# Altium project Shuttler_AMC.PrjPcb (part 17 of 20)

## Sheet FPGA_Banks_67_68.SchDoc: =ProjectName
size 420 x 297 mm; Author: T.P.; CompanyName: WUT; DrawnBy: T.P.; Organization: WUT ISE; Address1: Warsaw Univeristy of Technology; Address2: Nowowiejska 15/19; DocumentNumber: 9; Revision: 0.9; SheetNumber: 9; SheetTotal: 36; EDA_Number: ARTIQ; Projet: ARTIQ/SINARA; ModifiedBy: -; CreateDate: XX/XX/XXXX; CheckedDate: -; Title2: FPGA_Banks_67_68.SchDoc; DivGrp: ISE; Designer: G.K. and T.P.; ModifiedDate: -; ProjectName: ADC/DAC MEZZANINE
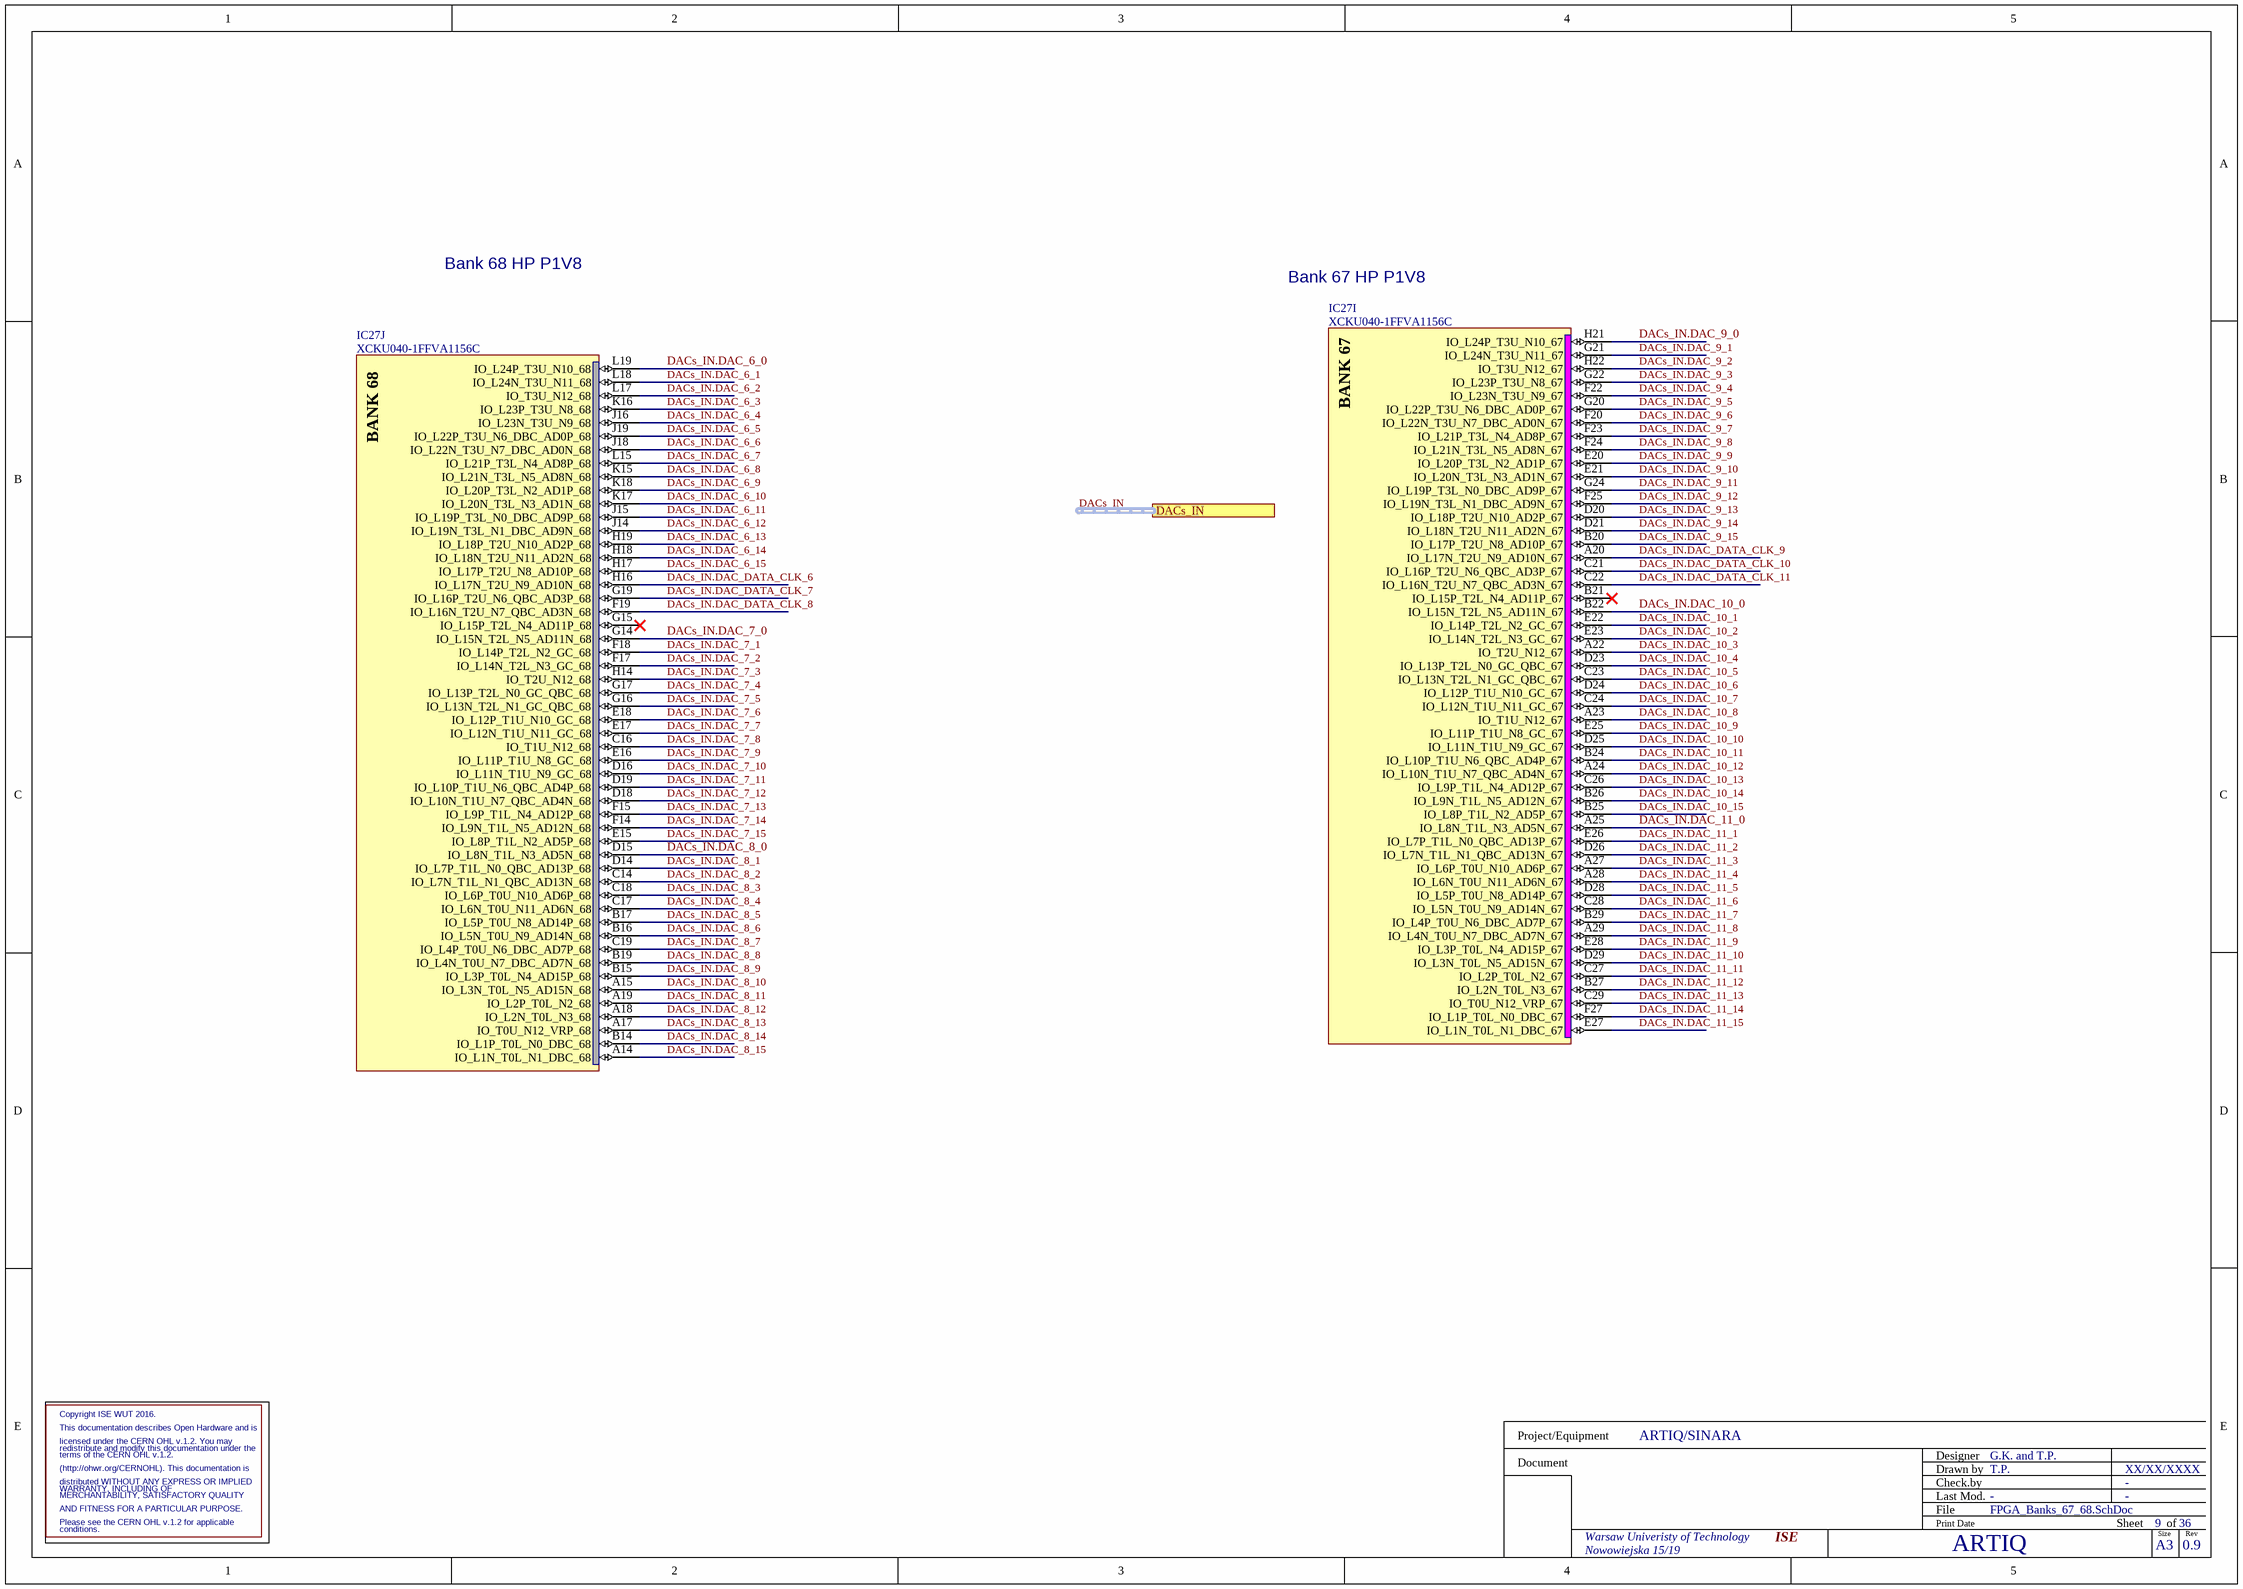
[diagram p31: FPGA_Banks_67_68.SchDoc]

### Parts
IC27  XCKU040-1FFVA1156C  [BGA1156C100P34X34_3500X3500X350]  (parts I,J of 22)

### Ports
DACs_IN (harness DAC_IN)

### Nets
DACs_IN.DAC_6_0: IC27.L19(IO_L24P_T3U_N10_68)
DACs_IN.DAC_6_1: IC27.L18(IO_L24N_T3U_N11_68)
DACs_IN.DAC_6_2: IC27.L17(IO_T3U_N12_68)
DACs_IN.DAC_6_3: IC27.K16(IO_L23P_T3U_N8_68)
DACs_IN.DAC_6_4: IC27.J16(IO_L23N_T3U_N9_68)
DACs_IN.DAC_6_5: IC27.J19(IO_L22P_T3U_N6_DBC_AD0P_68)
DACs_IN.DAC_6_6: IC27.J18(IO_L22N_T3U_N7_DBC_AD0N_68)
DACs_IN.DAC_6_7: IC27.L15(IO_L21P_T3L_N4_AD8P_68)
DACs_IN.DAC_6_8: IC27.K15(IO_L21N_T3L_N5_AD8N_68)
DACs_IN.DAC_6_9: IC27.K18(IO_L20P_T3L_N2_AD1P_68)
DACs_IN.DAC_6_10: IC27.K17(IO_L20N_T3L_N3_AD1N_68)
DACs_IN.DAC_6_11: IC27.J15(IO_L19P_T3L_N0_DBC_AD9P_68)
DACs_IN.DAC_6_12: IC27.J14(IO_L19N_T3L_N1_DBC_AD9N_68)
DACs_IN.DAC_6_13: IC27.H19(IO_L18P_T2U_N10_AD2P_68)
DACs_IN.DAC_6_14: IC27.H18(IO_L18N_T2U_N11_AD2N_68)
DACs_IN.DAC_6_15: IC27.H17(IO_L17P_T2U_N8_AD10P_68)
DACs_IN.DAC_7_0: IC27.G14(IO_L15N_T2L_N5_AD11N_68)
DACs_IN.DAC_7_1: IC27.F18(IO_L14P_T2L_N2_GC_68)
DACs_IN.DAC_7_2: IC27.F17(IO_L14N_T2L_N3_GC_68)
DACs_IN.DAC_7_3: IC27.H14(IO_T2U_N12_68)
DACs_IN.DAC_7_4: IC27.G17(IO_L13P_T2L_N0_GC_QBC_68)
DACs_IN.DAC_7_5: IC27.G16(IO_L13N_T2L_N1_GC_QBC_68)
DACs_IN.DAC_7_6: IC27.E18(IO_L12P_T1U_N10_GC_68)
DACs_IN.DAC_7_7: IC27.E17(IO_L12N_T1U_N11_GC_68)
DACs_IN.DAC_7_8: IC27.C16(IO_T1U_N12_68)
DACs_IN.DAC_7_9: IC27.E16(IO_L11P_T1U_N8_GC_68)
DACs_IN.DAC_7_10: IC27.D16(IO_L11N_T1U_N9_GC_68)
DACs_IN.DAC_7_11: IC27.D19(IO_L10P_T1U_N6_QBC_AD4P_68)
DACs_IN.DAC_7_12: IC27.D18(IO_L10N_T1U_N7_QBC_AD4N_68)
DACs_IN.DAC_7_13: IC27.F15(IO_L9P_T1L_N4_AD12P_68)
DACs_IN.DAC_7_14: IC27.F14(IO_L9N_T1L_N5_AD12N_68)
DACs_IN.DAC_7_15: IC27.E15(IO_L8P_T1L_N2_AD5P_68)
DACs_IN.DAC_8_0: IC27.D15(IO_L8N_T1L_N3_AD5N_68)
DACs_IN.DAC_8_1: IC27.D14(IO_L7P_T1L_N0_QBC_AD13P_68)
DACs_IN.DAC_8_2: IC27.C14(IO_L7N_T1L_N1_QBC_AD13N_68)
DACs_IN.DAC_8_3: IC27.C18(IO_L6P_T0U_N10_AD6P_68)
DACs_IN.DAC_8_4: IC27.C17(IO_L6N_T0U_N11_AD6N_68)
DACs_IN.DAC_8_5: IC27.B17(IO_L5P_T0U_N8_AD14P_68)
DACs_IN.DAC_8_6: IC27.B16(IO_L5N_T0U_N9_AD14N_68)
DACs_IN.DAC_8_7: IC27.C19(IO_L4P_T0U_N6_DBC_AD7P_68)
DACs_IN.DAC_8_8: IC27.B19(IO_L4N_T0U_N7_DBC_AD7N_68)
DACs_IN.DAC_8_9: IC27.B15(IO_L3P_T0L_N4_AD15P_68)
DACs_IN.DAC_8_10: IC27.A15(IO_L3N_T0L_N5_AD15N_68)
DACs_IN.DAC_8_11: IC27.A19(IO_L2P_T0L_N2_68)
DACs_IN.DAC_8_12: IC27.A18(IO_L2N_T0L_N3_68)
DACs_IN.DAC_8_13: IC27.A17(IO_T0U_N12_VRP_68)
DACs_IN.DAC_8_14: IC27.B14(IO_L1P_T0L_N0_DBC_68)
DACs_IN.DAC_8_15: IC27.A14(IO_L1N_T0L_N1_DBC_68)
DACs_IN.DAC_9_0: IC27.H21(IO_L24P_T3U_N10_67)
DACs_IN.DAC_9_1: IC27.G21(IO_L24N_T3U_N11_67)
DACs_IN.DAC_9_2: IC27.H22(IO_T3U_N12_67)
DACs_IN.DAC_9_3: IC27.G22(IO_L23P_T3U_N8_67)
DACs_IN.DAC_9_4: IC27.F22(IO_L23N_T3U_N9_67)
DACs_IN.DAC_9_5: IC27.G20(IO_L22P_T3U_N6_DBC_AD0P_67)
DACs_IN.DAC_9_6: IC27.F20(IO_L22N_T3U_N7_DBC_AD0N_67)
DACs_IN.DAC_9_7: IC27.F23(IO_L21P_T3L_N4_AD8P_67)
DACs_IN.DAC_9_8: IC27.F24(IO_L21N_T3L_N5_AD8N_67)
DACs_IN.DAC_9_9: IC27.E20(IO_L20P_T3L_N2_AD1P_67)
DACs_IN.DAC_9_10: IC27.E21(IO_L20N_T3L_N3_AD1N_67)
DACs_IN.DAC_9_11: IC27.G24(IO_L19P_T3L_N0_DBC_AD9P_67)
DACs_IN.DAC_9_12: IC27.F25(IO_L19N_T3L_N1_DBC_AD9N_67)
DACs_IN.DAC_9_13: IC27.D20(IO_L18P_T2U_N10_AD2P_67)
DACs_IN.DAC_9_14: IC27.D21(IO_L18N_T2U_N11_AD2N_67)
DACs_IN.DAC_9_15: IC27.B20(IO_L17P_T2U_N8_AD10P_67)
DACs_IN.DAC_10_0: IC27.B22(IO_L15N_T2L_N5_AD11N_67)
DACs_IN.DAC_10_1: IC27.E22(IO_L14P_T2L_N2_GC_67)
DACs_IN.DAC_10_2: IC27.E23(IO_L14N_T2L_N3_GC_67)
DACs_IN.DAC_10_3: IC27.A22(IO_T2U_N12_67)
DACs_IN.DAC_10_4: IC27.D23(IO_L13P_T2L_N0_GC_QBC_67)
DACs_IN.DAC_10_5: IC27.C23(IO_L13N_T2L_N1_GC_QBC_67)
DACs_IN.DAC_10_6: IC27.D24(IO_L12P_T1U_N10_GC_67)
DACs_IN.DAC_10_7: IC27.C24(IO_L12N_T1U_N11_GC_67)
DACs_IN.DAC_10_8: IC27.A23(IO_T1U_N12_67)
DACs_IN.DAC_10_9: IC27.E25(IO_L11P_T1U_N8_GC_67)
DACs_IN.DAC_10_10: IC27.D25(IO_L11N_T1U_N9_GC_67)
DACs_IN.DAC_10_11: IC27.B24(IO_L10P_T1U_N6_QBC_AD4P_67)
DACs_IN.DAC_10_12: IC27.A24(IO_L10N_T1U_N7_QBC_AD4N_67)
DACs_IN.DAC_10_13: IC27.C26(IO_L9P_T1L_N4_AD12P_67)
DACs_IN.DAC_10_14: IC27.B26(IO_L9N_T1L_N5_AD12N_67)
DACs_IN.DAC_10_15: IC27.B25(IO_L8P_T1L_N2_AD5P_67)
DACs_IN.DAC_11_0: IC27.A25(IO_L8N_T1L_N3_AD5N_67)
DACs_IN.DAC_11_1: IC27.E26(IO_L7P_T1L_N0_QBC_AD13P_67)
DACs_IN.DAC_11_2: IC27.D26(IO_L7N_T1L_N1_QBC_AD13N_67)
DACs_IN.DAC_11_3: IC27.A27(IO_L6P_T0U_N10_AD6P_67)
DACs_IN.DAC_11_4: IC27.A28(IO_L6N_T0U_N11_AD6N_67)
DACs_IN.DAC_11_5: IC27.D28(IO_L5P_T0U_N8_AD14P_67)
DACs_IN.DAC_11_6: IC27.C28(IO_L5N_T0U_N9_AD14N_67)
DACs_IN.DAC_11_7: IC27.B29(IO_L4P_T0U_N6_DBC_AD7P_67)
DACs_IN.DAC_11_8: IC27.A29(IO_L4N_T0U_N7_DBC_AD7N_67)
DACs_IN.DAC_11_9: IC27.E28(IO_L3P_T0L_N4_AD15P_67)
DACs_IN.DAC_11_10: IC27.D29(IO_L3N_T0L_N5_AD15N_67)
DACs_IN.DAC_11_11: IC27.C27(IO_L2P_T0L_N2_67)
DACs_IN.DAC_11_12: IC27.B27(IO_L2N_T0L_N3_67)
DACs_IN.DAC_11_13: IC27.C29(IO_T0U_N12_VRP_67)
DACs_IN.DAC_11_14: IC27.F27(IO_L1P_T0L_N0_DBC_67)
DACs_IN.DAC_11_15: IC27.E27(IO_L1N_T0L_N1_DBC_67)
DACs_IN.DAC_DATA_CLK_6: IC27.H16(IO_L17N_T2U_N9_AD10N_68)
DACs_IN.DAC_DATA_CLK_7: IC27.G19(IO_L16P_T2U_N6_QBC_AD3P_68)
DACs_IN.DAC_DATA_CLK_8: IC27.F19(IO_L16N_T2U_N7_QBC_AD3N_68)
DACs_IN.DAC_DATA_CLK_9: IC27.A20(IO_L17N_T2U_N9_AD10N_67)
DACs_IN.DAC_DATA_CLK_10: IC27.C21(IO_L16P_T2U_N6_QBC_AD3P_67)
DACs_IN.DAC_DATA_CLK_11: IC27.C22(IO_L16N_T2U_N7_QBC_AD3N_67)

Not connected (* = marked no-connect by the designer): IC27 B21(IO_L15P_T2L_N4_AD11P_67)* G15(IO_L15P_T2L_N4_AD11P_68)*

### Buses and harness runs
harness DACs_IN = port DACs_IN

### Notes on the sheet
- Bank 68 HP P1V8
- Bank 67 HP P1V8
- Copyright ISE WUT 2016.
- This documentation describes Open Hardware and is
- licensed under the CERN OHL v.1.2. You may
- (http://ohwr.org/CERNOHL). This documentation is
- WARRANTY, INCLUDING OF
- terms of the CERN OHL v.1.2.
- distributed WITHOUT ANY EXPRESS OR IMPLIED
- redistribute and modify this documentation under the
- conditions.
- AND FITNESS FOR A PARTICULAR PURPOSE.
- Please see the CERN OHL v.1.2 for applicable
- MERCHANTABILITY, SATISFACTORY QUALITY
- Project/Equipment
- Document
- Designer
- Drawn by
- Check.by
- File
- Last Mod.
- Print Date
- Sheet
- Size
- A3
- of
- Rev
- (in symbol XCKU040-1FFVA1156C, part I) BANK 67
- (in symbol XCKU040-1FFVA1156C, part J) BANK 68

### Library data of the parts
IC27 = XCKU040-1FFVA1156C: Kintex UltraScale FPGA, 520 I/O, 530K Cells, 1156-Ball BGA, Speed Grade 1, Commercial Grade; Manufacturer: XILINX; Part Description: Kintex UltraScale, 40 DLL I/O, 416 HP I/O, 104 HR I/O, 1156-Pin BGA, Speed Grade 1, Commercial Grade; PressFit: No; Bonding: No; Manufacturer Part Number: XCKU040-1FFVA1156C; PackageDescription: BGA, 1.00mm Pitch, Square; 1156 Pin, 34 Columns X 34 Rows, Body 35.00mm X 35.00mm X 3.50mm H, IPC Medium Density; Part Number: XCKU040-1FFVA1156C; Component Kind: Standard; Component Type: Standard; Device: XCKU040-1FFVA1156C; Pin Count: 1156; Case: BGA1156; Mounted: Yes; Socket: No; SMD: Yes; Sense: No; ComponentHeight: 3.5mm; HelpURL: \\cern.ch\dfs\Applications\Altium\Datasheets\XCKU040-1FFVA1156C.pdf; ComponentLink1URL: \\cern.ch\dfs\Applications\Altium\Datasheets\XCKU040-1FFVA1156C_Package-Pinout.pdf; ComponentLink1Description: Package/Pinout; Author: CERN DEM CA; CreateDate: 16.08.2016; LatestRevisionDate: 16.08.2016

## Sheet FPGA_Bank_66_HP.SchDoc: =ProjectName
size 420 x 297 mm; Author: T.P.; CompanyName: WUT; DrawnBy: T.P.; Organization: WUT ISE; Address1: Warsaw Univeristy of Technology; Address2: Nowowiejska 15/19; DocumentNumber: 8; Revision: 0.9; SheetNumber: 8; SheetTotal: 36; EDA_Number: ARTIQ; Projet: ARTIQ/SINARA; ModifiedBy: -; CreateDate: XX/XX/XXXX; CheckedDate: -; Title2: FPGA_Bank_66_HP.SchDoc; DivGrp: ISE; Designer: G.K. and T.P.; ModifiedDate: -; ProjectName: ADC/DAC MEZZANINE
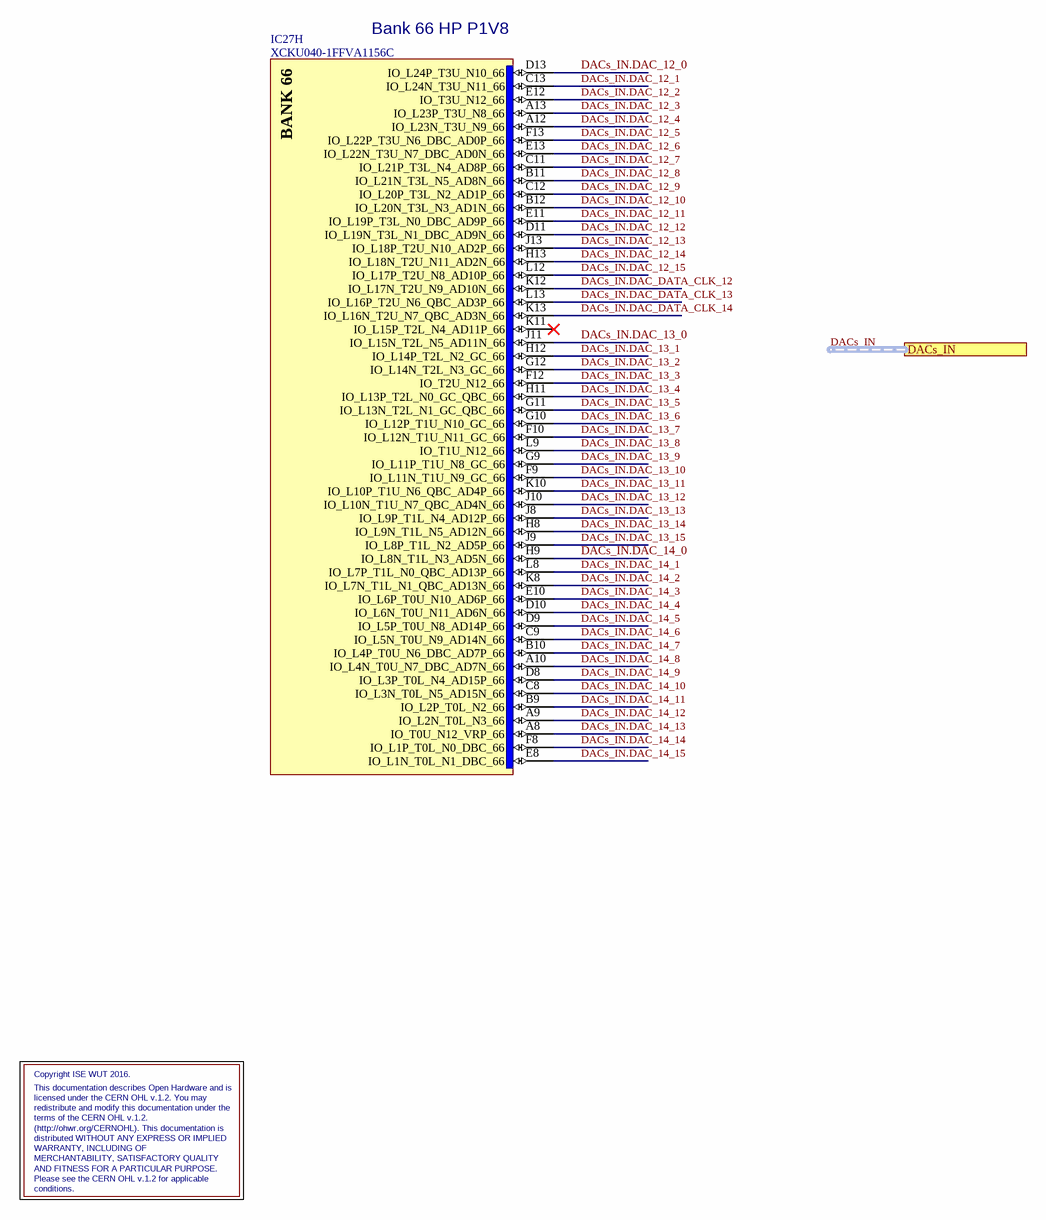
[diagram p32: FPGA_Bank_66_HP.SchDoc]

### Parts
IC27  XCKU040-1FFVA1156C  [BGA1156C100P34X34_3500X3500X350]  (part H of 22)

### Ports
DACs_IN (harness DAC_IN)

### Nets
DACs_IN.DAC_12_0: IC27.D13(IO_L24P_T3U_N10_66)
DACs_IN.DAC_12_1: IC27.C13(IO_L24N_T3U_N11_66)
DACs_IN.DAC_12_2: IC27.E12(IO_T3U_N12_66)
DACs_IN.DAC_12_3: IC27.A13(IO_L23P_T3U_N8_66)
DACs_IN.DAC_12_4: IC27.A12(IO_L23N_T3U_N9_66)
DACs_IN.DAC_12_5: IC27.F13(IO_L22P_T3U_N6_DBC_AD0P_66)
DACs_IN.DAC_12_6: IC27.E13(IO_L22N_T3U_N7_DBC_AD0N_66)
DACs_IN.DAC_12_7: IC27.C11(IO_L21P_T3L_N4_AD8P_66)
DACs_IN.DAC_12_8: IC27.B11(IO_L21N_T3L_N5_AD8N_66)
DACs_IN.DAC_12_9: IC27.C12(IO_L20P_T3L_N2_AD1P_66)
DACs_IN.DAC_12_10: IC27.B12(IO_L20N_T3L_N3_AD1N_66)
DACs_IN.DAC_12_11: IC27.E11(IO_L19P_T3L_N0_DBC_AD9P_66)
DACs_IN.DAC_12_12: IC27.D11(IO_L19N_T3L_N1_DBC_AD9N_66)
DACs_IN.DAC_12_13: IC27.J13(IO_L18P_T2U_N10_AD2P_66)
DACs_IN.DAC_12_14: IC27.H13(IO_L18N_T2U_N11_AD2N_66)
DACs_IN.DAC_12_15: IC27.L12(IO_L17P_T2U_N8_AD10P_66)
DACs_IN.DAC_13_0: IC27.J11(IO_L15N_T2L_N5_AD11N_66)
DACs_IN.DAC_13_1: IC27.H12(IO_L14P_T2L_N2_GC_66)
DACs_IN.DAC_13_2: IC27.G12(IO_L14N_T2L_N3_GC_66)
DACs_IN.DAC_13_3: IC27.F12(IO_T2U_N12_66)
DACs_IN.DAC_13_4: IC27.H11(IO_L13P_T2L_N0_GC_QBC_66)
DACs_IN.DAC_13_5: IC27.G11(IO_L13N_T2L_N1_GC_QBC_66)
DACs_IN.DAC_13_6: IC27.G10(IO_L12P_T1U_N10_GC_66)
DACs_IN.DAC_13_7: IC27.F10(IO_L12N_T1U_N11_GC_66)
DACs_IN.DAC_13_8: IC27.L9(IO_T1U_N12_66)
DACs_IN.DAC_13_9: IC27.G9(IO_L11P_T1U_N8_GC_66)
DACs_IN.DAC_13_10: IC27.F9(IO_L11N_T1U_N9_GC_66)
DACs_IN.DAC_13_11: IC27.K10(IO_L10P_T1U_N6_QBC_AD4P_66)
DACs_IN.DAC_13_12: IC27.J10(IO_L10N_T1U_N7_QBC_AD4N_66)
DACs_IN.DAC_13_13: IC27.J8(IO_L9P_T1L_N4_AD12P_66)
DACs_IN.DAC_13_14: IC27.H8(IO_L9N_T1L_N5_AD12N_66)
DACs_IN.DAC_13_15: IC27.J9(IO_L8P_T1L_N2_AD5P_66)
DACs_IN.DAC_14_0: IC27.H9(IO_L8N_T1L_N3_AD5N_66)
DACs_IN.DAC_14_1: IC27.L8(IO_L7P_T1L_N0_QBC_AD13P_66)
DACs_IN.DAC_14_2: IC27.K8(IO_L7N_T1L_N1_QBC_AD13N_66)
DACs_IN.DAC_14_3: IC27.E10(IO_L6P_T0U_N10_AD6P_66)
DACs_IN.DAC_14_4: IC27.D10(IO_L6N_T0U_N11_AD6N_66)
DACs_IN.DAC_14_5: IC27.D9(IO_L5P_T0U_N8_AD14P_66)
DACs_IN.DAC_14_6: IC27.C9(IO_L5N_T0U_N9_AD14N_66)
DACs_IN.DAC_14_7: IC27.B10(IO_L4P_T0U_N6_DBC_AD7P_66)
DACs_IN.DAC_14_8: IC27.A10(IO_L4N_T0U_N7_DBC_AD7N_66)
DACs_IN.DAC_14_9: IC27.D8(IO_L3P_T0L_N4_AD15P_66)
DACs_IN.DAC_14_10: IC27.C8(IO_L3N_T0L_N5_AD15N_66)
DACs_IN.DAC_14_11: IC27.B9(IO_L2P_T0L_N2_66)
DACs_IN.DAC_14_12: IC27.A9(IO_L2N_T0L_N3_66)
DACs_IN.DAC_14_13: IC27.A8(IO_T0U_N12_VRP_66)
DACs_IN.DAC_14_14: IC27.F8(IO_L1P_T0L_N0_DBC_66)
DACs_IN.DAC_14_15: IC27.E8(IO_L1N_T0L_N1_DBC_66)
DACs_IN.DAC_DATA_CLK_12: IC27.K12(IO_L17N_T2U_N9_AD10N_66)
DACs_IN.DAC_DATA_CLK_13: IC27.L13(IO_L16P_T2U_N6_QBC_AD3P_66)
DACs_IN.DAC_DATA_CLK_14: IC27.K13(IO_L16N_T2U_N7_QBC_AD3N_66)

Not connected (* = marked no-connect by the designer): IC27 K11(IO_L15P_T2L_N4_AD11P_66)*

### Buses and harness runs
harness DACs_IN = port DACs_IN

### Notes on the sheet
- (near IC27) Bank 66 HP P1V8
- Copyright ISE WUT 2016.
- WARRANTY, INCLUDING OF
- redistribute and modify this documentation under the
- distributed WITHOUT ANY EXPRESS OR IMPLIED
- terms of the CERN OHL v.1.2.
- licensed under the CERN OHL v.1.2. You may
- This documentation describes Open Hardware and is
- (http://ohwr.org/CERNOHL). This documentation is
- conditions.
- AND FITNESS FOR A PARTICULAR PURPOSE.
- MERCHANTABILITY, SATISFACTORY QUALITY
- Please see the CERN OHL v.1.2 for applicable
- Project/Equipment
- Document
- Designer
- Drawn by
- Check.by
- File
- Last Mod.
- Print Date
- Sheet
- Size
- A3
- of
- Rev
- (in symbol XCKU040-1FFVA1156C, part H) BANK 66

### Library data of the parts
IC27 = XCKU040-1FFVA1156C: as IC27 on sheet FPGA_Banks_67_68; Manufacturer Part Number: XCKU040-1FFVA1156C; PackageDescription: BGA, 1.00mm Pitch, Square; 1156 Pin, 34 Columns X 34 Rows, Body 35.00mm X 35.00mm X 3.50mm H, IPC Medium Density; Part Number: XCKU040-1FFVA1156C; Component Kind: Standard; Component Type: Standard; Device: XCKU040-1FFVA1156C; Pin Count: 1156; Case: BGA1156; Mounted: Yes; Socket: No; SMD: Yes; Sense: No; ComponentHeight: 3.5mm; HelpURL: \\cern.ch\dfs\Applications\Altium\Datasheets\XCKU040-1FFVA1156C.pdf; ComponentLink1URL: \\cern.ch\dfs\Applications\Altium\Datasheets\XCKU040-1FFVA1156C_Package-Pinout.pdf; ComponentLink1Description: Package/Pinout; Author: CERN DEM CA; CreateDate: 16.08.2016; LatestRevisionDate: 16.08.2016

## Sheet FPGA_Banks_64_65_HR.SchDoc: =ProjectName
size 420 x 297 mm; Author: T.P.; CompanyName: WUT; DrawnBy: T.P.; Organization: WUT ISE; Address1: Warsaw Univeristy of Technology; Address2: Nowowiejska 25/29; DocumentNumber: 7; Revision: 0.9; SheetNumber: 7; SheetTotal: 36; EDA_Number: ARTIQ; Projet: ARTIQ/SINARA; ModifiedBy: -; CreateDate: XX/XX/XXXX; CheckedDate: -; Title2: FPGA_Banks_64_65_HR.SchDoc; DivGrp: ISE; Designer: G.K. and T.P.; ModifiedDate: -; ProjectName: ADC/DAC MEZZANINE
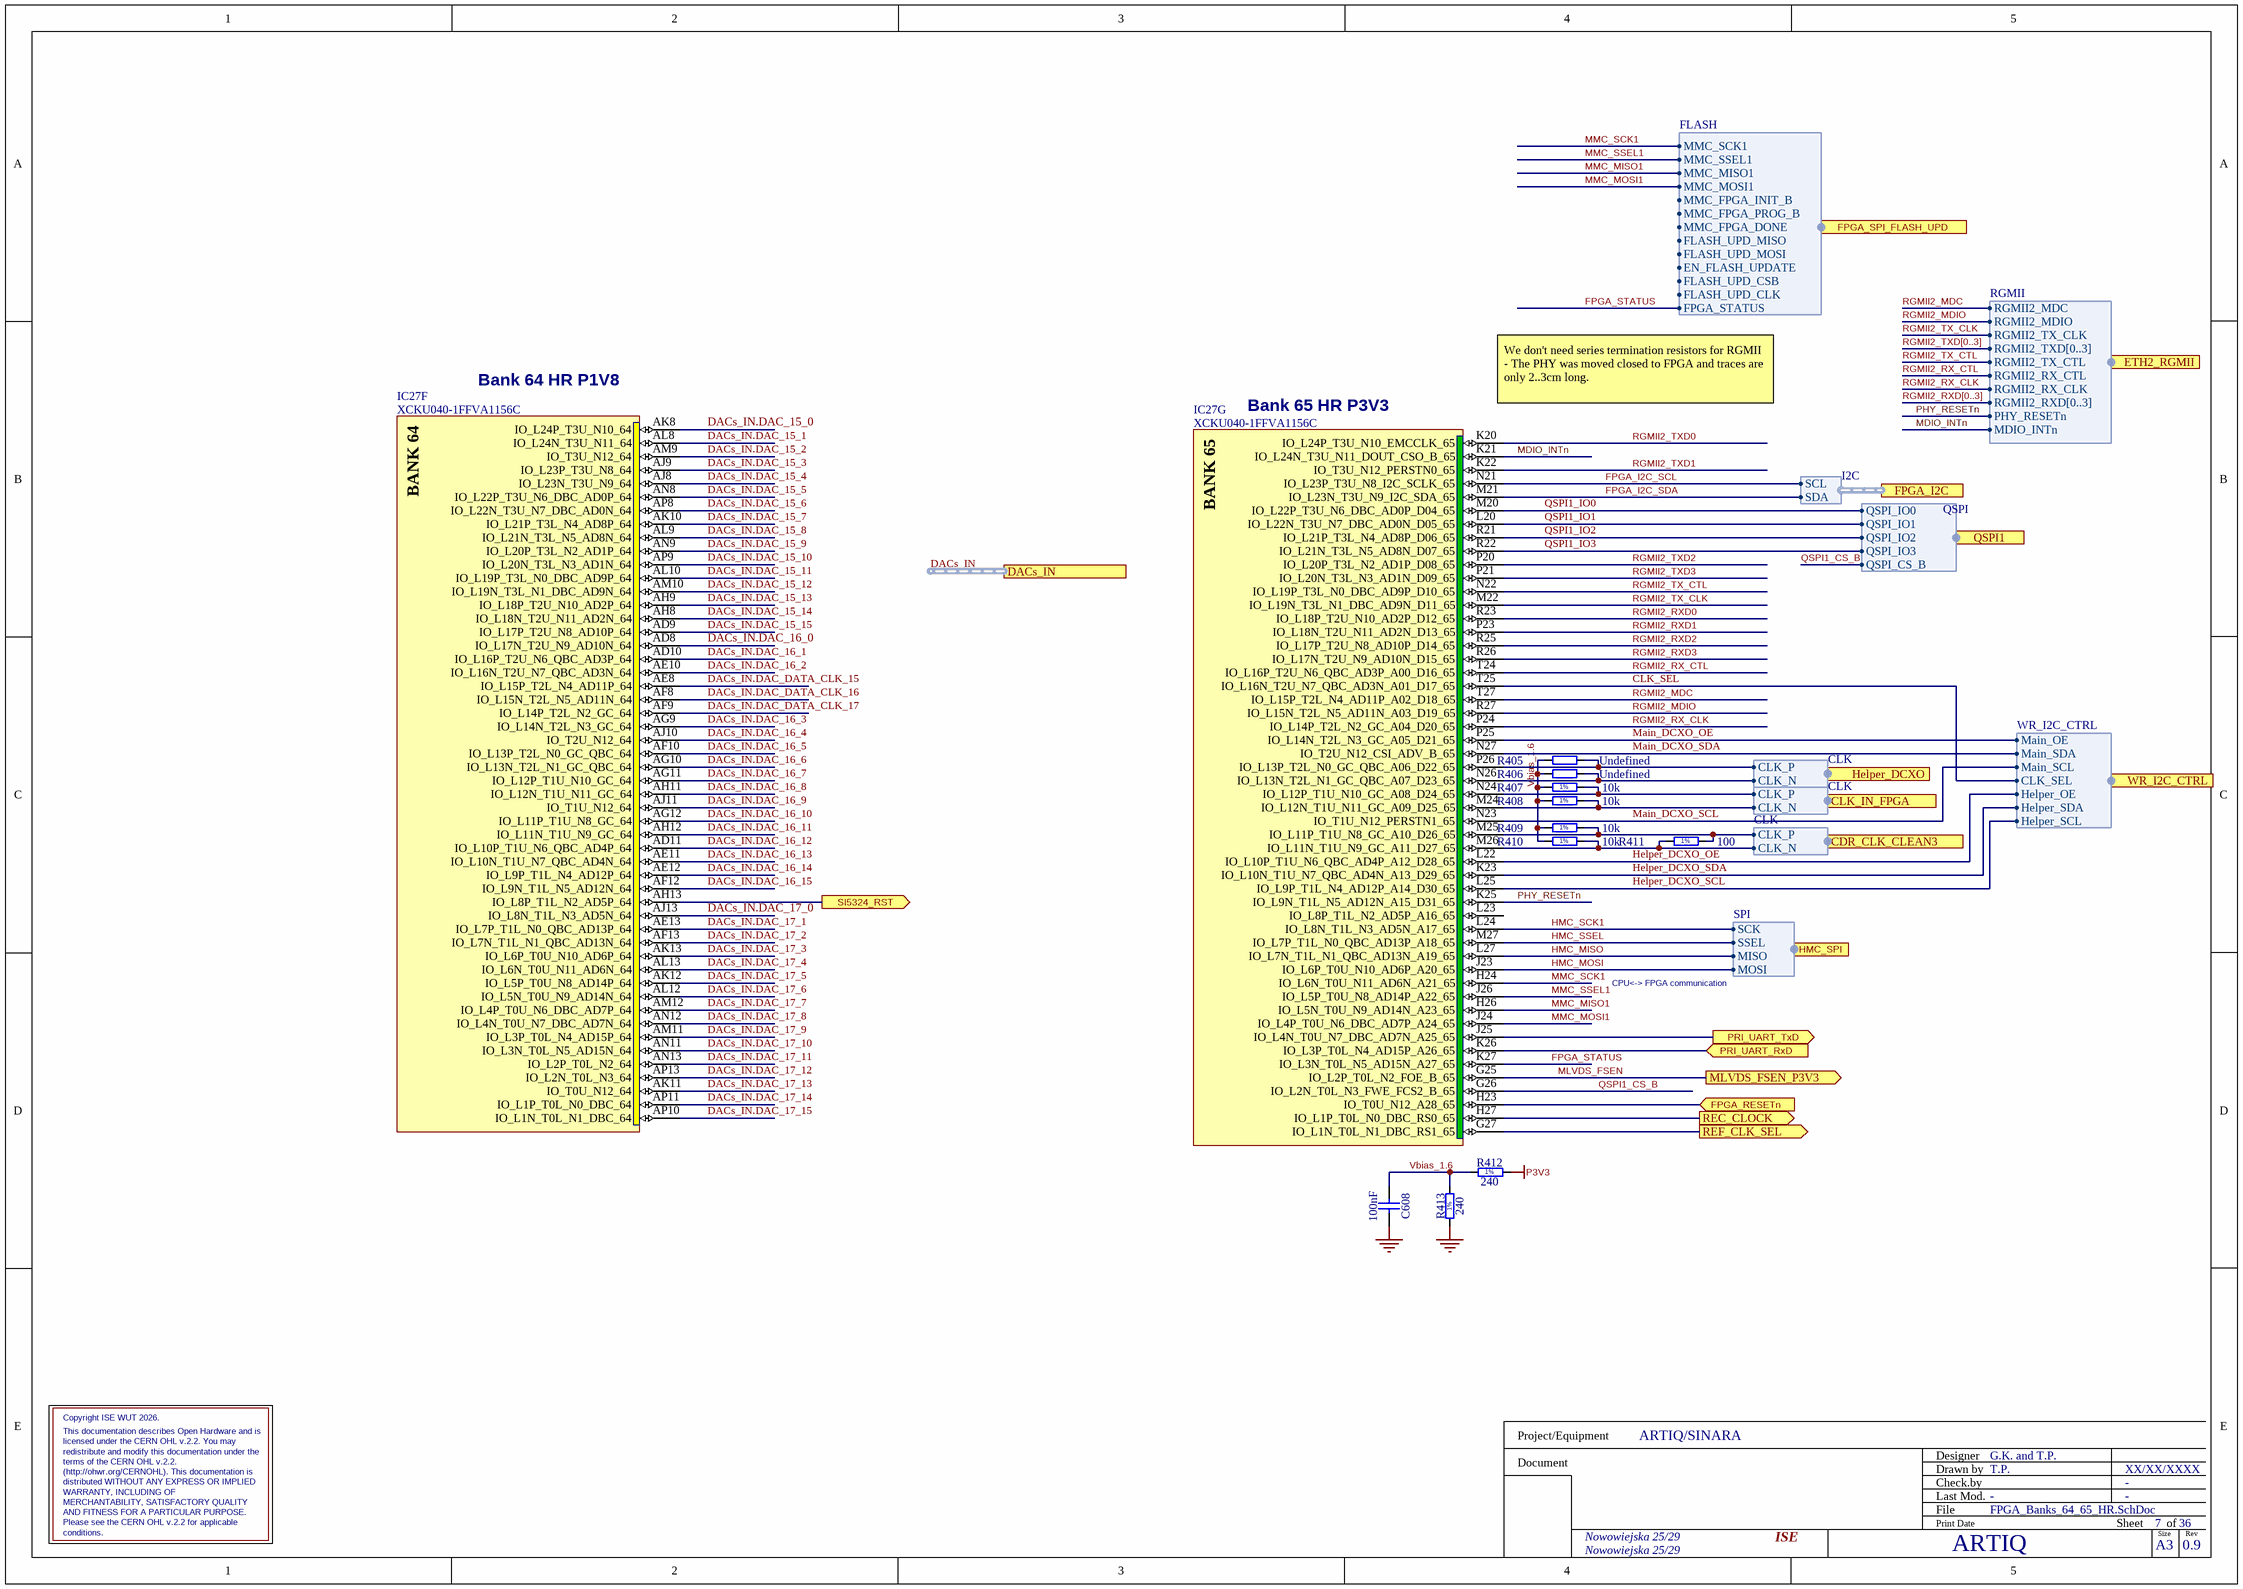
[diagram p33: FPGA_Banks_64_65_HR.SchDoc]

### Parts
C608  100nF  [CAPC0603X33N]
IC27  XCKU040-1FFVA1156C  [BGA1156C100P34X34_3500X3500X350]  (parts F,G of 22)
R405  Undefined  [RESC1005X40N]
R406  Undefined  [RESC1005X40N]
R407  10k  [RESC1005X40N]
R408  10k  [RESC1005X40N]
R409  10k  [RESC1005X40N]
R410  10k  [RESC1005X40N]
R411  100  [RESC1005X40N]
R412  240  [RESC1005X40N]
R413  240  [RESC1005X40N]

### Ports
CDR_CLK_CLEAN3 (harness CLK), CLK_IN_FPGA (harness CLK), DACs_IN (harness DAC_IN), ETH2_RGMII (harness RGMII), FPGA_I2C (harness I2C), FPGA_RESETn (in), FPGA_SPI_FLASH_UPD (harness FLASH), Helper_DCXO (harness CLK), HMC_SPI (harness SPI), MLVDS_FSEN_P3V3 (out), PRI_UART_RxD (in), PRI_UART_TxD (out), QSPI1 (harness QSPI), REC_CLOCK (out), REF_CLK_SEL (out), SI5324_RST (out), WR_I2C_CTRL (harness WR_I2C_CTRL)

### Harnesses
I2C: SCL, SDA
FLASH: MMC_SCK1, MMC_SSEL1, MMC_MISO1, MMC_MOSI1, MMC_FPGA_INIT_B, MMC_FPGA_PROG_B, MMC_FPGA_DONE, FLASH_UPD_MISO, FLASH_UPD_MOSI, EN_FLASH_UPDATE, FLASH_UPD_CSB, FLASH_UPD_CLK, FPGA_STATUS
CLK: CLK_N, CLK_P
QSPI: QSPI_IO1, QSPI_IO2, QSPI_IO3, QSPI_IO0, QSPI_CS_B
WR_I2C_CTRL: Main_OE, Main_SDA, Main_SCL, Helper_OE, Helper_SDA, Helper_SCL, CLK_SEL
SPI: SCK, SSEL, MISO, MOSI
RGMII: RGMII2_MDC, RGMII2_MDIO, RGMII2_TX_CLK, RGMII2_TXD[0..3], RGMII2_TX_CTL, RGMII2_RX_CTL, RGMII2_RX_CLK, RGMII2_RXD[0..3], PHY_RESETn, MDIO_INTn

### Nets
GND: C608.2 R413.1
P3V3: R412.2
CDR_CLK_CLEAN3_N: IC27.M26(IO_L11N_T1U_N9_GC_A11_D27_65) R410.2 R411.1 ; port CDR_CLK_CLEAN3.CLK_N
CDR_CLK_CLEAN3_P: IC27.M25(IO_L11P_T1U_N8_GC_A10_D26_65) R409.2 R411.2 ; port CDR_CLK_CLEAN3.CLK_P
CLK_IN_FPGA.CLK_N: IC27.M24(IO_L12N_T1U_N11_GC_A09_D25_65) R408.2 ; port CLK_IN_FPGA.CLK_N
CLK_IN_FPGA.CLK_P: IC27.N24(IO_L12P_T1U_N10_GC_A08_D24_65) R407.2 ; port CLK_IN_FPGA.CLK_P
CLK_SEL: IC27.T25(IO_L16N_T2U_N7_QBC_AD3N_A01_D17_65) ; port WR_I2C_CTRL.CLK_SEL
DACs_IN.DAC_15_0: IC27.AK8(IO_L24P_T3U_N10_64)
DACs_IN.DAC_15_1: IC27.AL8(IO_L24N_T3U_N11_64)
DACs_IN.DAC_15_2: IC27.AM9(IO_T3U_N12_64)
DACs_IN.DAC_15_3: IC27.AJ9(IO_L23P_T3U_N8_64)
DACs_IN.DAC_15_4: IC27.AJ8(IO_L23N_T3U_N9_64)
DACs_IN.DAC_15_5: IC27.AN8(IO_L22P_T3U_N6_DBC_AD0P_64)
DACs_IN.DAC_15_6: IC27.AP8(IO_L22N_T3U_N7_DBC_AD0N_64)
DACs_IN.DAC_15_7: IC27.AK10(IO_L21P_T3L_N4_AD8P_64)
DACs_IN.DAC_15_8: IC27.AL9(IO_L21N_T3L_N5_AD8N_64)
DACs_IN.DAC_15_9: IC27.AN9(IO_L20P_T3L_N2_AD1P_64)
DACs_IN.DAC_15_10: IC27.AP9(IO_L20N_T3L_N3_AD1N_64)
DACs_IN.DAC_15_11: IC27.AL10(IO_L19P_T3L_N0_DBC_AD9P_64)
DACs_IN.DAC_15_12: IC27.AM10(IO_L19N_T3L_N1_DBC_AD9N_64)
DACs_IN.DAC_15_13: IC27.AH9(IO_L18P_T2U_N10_AD2P_64)
DACs_IN.DAC_15_14: IC27.AH8(IO_L18N_T2U_N11_AD2N_64)
DACs_IN.DAC_15_15: IC27.AD9(IO_L17P_T2U_N8_AD10P_64)
DACs_IN.DAC_16_0: IC27.AD8(IO_L17N_T2U_N9_AD10N_64)
DACs_IN.DAC_16_1: IC27.AD10(IO_L16P_T2U_N6_QBC_AD3P_64)
DACs_IN.DAC_16_2: IC27.AE10(IO_L16N_T2U_N7_QBC_AD3N_64)
DACs_IN.DAC_16_3: IC27.AG9(IO_L14N_T2L_N3_GC_64)
DACs_IN.DAC_16_4: IC27.AJ10(IO_T2U_N12_64)
DACs_IN.DAC_16_5: IC27.AF10(IO_L13P_T2L_N0_GC_QBC_64)
DACs_IN.DAC_16_6: IC27.AG10(IO_L13N_T2L_N1_GC_QBC_64)
DACs_IN.DAC_16_7: IC27.AG11(IO_L12P_T1U_N10_GC_64)
DACs_IN.DAC_16_8: IC27.AH11(IO_L12N_T1U_N11_GC_64)
DACs_IN.DAC_16_9: IC27.AJ11(IO_T1U_N12_64)
DACs_IN.DAC_16_10: IC27.AG12(IO_L11P_T1U_N8_GC_64)
DACs_IN.DAC_16_11: IC27.AH12(IO_L11N_T1U_N9_GC_64)
DACs_IN.DAC_16_12: IC27.AD11(IO_L10P_T1U_N6_QBC_AD4P_64)
DACs_IN.DAC_16_13: IC27.AE11(IO_L10N_T1U_N7_QBC_AD4N_64)
DACs_IN.DAC_16_14: IC27.AE12(IO_L9P_T1L_N4_AD12P_64)
DACs_IN.DAC_16_15: IC27.AF12(IO_L9N_T1L_N5_AD12N_64)
DACs_IN.DAC_17_0: IC27.AJ13(IO_L8N_T1L_N3_AD5N_64)
DACs_IN.DAC_17_1: IC27.AE13(IO_L7P_T1L_N0_QBC_AD13P_64)
DACs_IN.DAC_17_2: IC27.AF13(IO_L7N_T1L_N1_QBC_AD13N_64)
DACs_IN.DAC_17_3: IC27.AK13(IO_L6P_T0U_N10_AD6P_64)
DACs_IN.DAC_17_4: IC27.AL13(IO_L6N_T0U_N11_AD6N_64)
DACs_IN.DAC_17_5: IC27.AK12(IO_L5P_T0U_N8_AD14P_64)
DACs_IN.DAC_17_6: IC27.AL12(IO_L5N_T0U_N9_AD14N_64)
DACs_IN.DAC_17_7: IC27.AM12(IO_L4P_T0U_N6_DBC_AD7P_64)
DACs_IN.DAC_17_8: IC27.AN12(IO_L4N_T0U_N7_DBC_AD7N_64)
DACs_IN.DAC_17_9: IC27.AM11(IO_L3P_T0L_N4_AD15P_64)
DACs_IN.DAC_17_10: IC27.AN11(IO_L3N_T0L_N5_AD15N_64)
DACs_IN.DAC_17_11: IC27.AN13(IO_L2P_T0L_N2_64)
DACs_IN.DAC_17_12: IC27.AP13(IO_L2N_T0L_N3_64)
DACs_IN.DAC_17_13: IC27.AK11(IO_T0U_N12_64)
DACs_IN.DAC_17_14: IC27.AP11(IO_L1P_T0L_N0_DBC_64)
DACs_IN.DAC_17_15: IC27.AP10(IO_L1N_T0L_N1_DBC_64)
DACs_IN.DAC_DATA_CLK_15: IC27.AE8(IO_L15P_T2L_N4_AD11P_64)
DACs_IN.DAC_DATA_CLK_16: IC27.AF8(IO_L15N_T2L_N5_AD11N_64)
DACs_IN.DAC_DATA_CLK_17: IC27.AF9(IO_L14P_T2L_N2_GC_64)
FPGA_I2C_SCL: IC27.N21(IO_L23P_T3U_N8_I2C_SCLK_65) ; port FPGA_I2C.SCL  [project net FPGA_I2C.SCL]
FPGA_I2C_SDA: IC27.M21(IO_L23N_T3U_N9_I2C_SDA_65) ; port FPGA_I2C.SDA  [project net FPGA_I2C.SDA]
FPGA_RESETn: IC27.H23(IO_T0U_N12_A28_65) ; port FPGA_RESETn
FPGA_STATUS: IC27.K27(IO_L3N_T0L_N5_AD15N_A27_65) ; port FPGA_SPI_FLASH_UPD.FPGA_STATUS  [project net FPGA_SPI_FLASH_UPD.FPGA_STATUS]
Helper_DCXO_N: IC27.N26(IO_L13N_T2L_N1_GC_QBC_A07_D23_65) R406.2 ; port Helper_DCXO.CLK_N
Helper_DCXO_OE: IC27.L22(IO_L10P_T1U_N6_QBC_AD4P_A12_D28_65) ; port WR_I2C_CTRL.Helper_OE
Helper_DCXO_P: IC27.P26(IO_L13P_T2L_N0_GC_QBC_A06_D22_65) R405.2 ; port Helper_DCXO.CLK_P
Helper_DCXO_SCL: IC27.L25(IO_L9P_T1L_N4_AD12P_A14_D30_65) ; port WR_I2C_CTRL.Helper_SCL
Helper_DCXO_SDA: IC27.K23(IO_L10N_T1U_N7_QBC_AD4N_A13_D29_65) ; port WR_I2C_CTRL.Helper_SDA
HMC_MISO: IC27.L27(IO_L7N_T1L_N1_QBC_AD13N_A19_65) ; port HMC_SPI.MISO
HMC_MOSI: IC27.J23(IO_L6P_T0U_N10_AD6P_A20_65) ; port HMC_SPI.MOSI
HMC_SCK1: IC27.L24(IO_L8N_T1L_N3_AD5N_A17_65) ; port HMC_SPI.SCK
HMC_SSEL: IC27.M27(IO_L7P_T1L_N0_QBC_AD13P_A18_65) ; port HMC_SPI.SSEL
Main_DCXO_OE: IC27.P25(IO_L14N_T2L_N3_GC_A05_D21_65) ; port WR_I2C_CTRL.Main_OE
Main_DCXO_SCL: IC27.N23(IO_T1U_N12_PERSTN1_65) ; port WR_I2C_CTRL.Main_SCL
Main_DCXO_SDA: IC27.N27(IO_T2U_N12_CSI_ADV_B_65) ; port WR_I2C_CTRL.Main_SDA
MDIO_INTn: IC27.K21(IO_L24N_T3U_N11_DOUT_CSO_B_65) ; port ETH2_RGMII.MDIO_INTn  [project net ETH2_RGMII.MDIO_INTn]
MLVDS_FSEN: IC27.G25(IO_L2P_T0L_N2_FOE_B_65) ; port MLVDS_FSEN_P3V3
MMC_MISO1: IC27.H26(IO_L5N_T0U_N9_AD14N_A23_65) ; port FPGA_SPI_FLASH_UPD.MMC_MISO1  [project net FPGA_SPI_FLASH_UPD.MMC_MISO1]
MMC_MOSI1: IC27.J24(IO_L4P_T0U_N6_DBC_AD7P_A24_65) ; port FPGA_SPI_FLASH_UPD.MMC_MOSI1  [project net FPGA_SPI_FLASH_UPD.MMC_MOSI1]
MMC_SCK1: IC27.H24(IO_L6N_T0U_N11_AD6N_A21_65) ; port FPGA_SPI_FLASH_UPD.MMC_SCK1  [project net FPGA_SPI_FLASH_UPD.MMC_SCK1]
MMC_SSEL1: IC27.J26(IO_L5P_T0U_N8_AD14P_A22_65) ; port FPGA_SPI_FLASH_UPD.MMC_SSEL1  [project net FPGA_SPI_FLASH_UPD.MMC_SSEL1]
PHY_RESETn: IC27.K25(IO_L9N_T1L_N5_AD12N_A15_D31_65) ; port ETH2_RGMII.PHY_RESETn  [project net ETH2_RGMII.PHY_RESETn]
PRI_UART_RxD: IC27.K26(IO_L3P_T0L_N4_AD15P_A26_65) ; port PRI_UART_RxD
PRI_UART_TxD: IC27.J25(IO_L4N_T0U_N7_DBC_AD7N_A25_65) ; port PRI_UART_TxD
QSPI1_CS_B: IC27.G26(IO_L2N_T0L_N3_FWE_FCS2_B_65) ; port QSPI1.QSPI_CS_B
QSPI1_IO0: IC27.M20(IO_L22P_T3U_N6_DBC_AD0P_D04_65) ; port QSPI1.QSPI_IO0
QSPI1_IO1: IC27.L20(IO_L22N_T3U_N7_DBC_AD0N_D05_65) ; port QSPI1.QSPI_IO1
QSPI1_IO2: IC27.R21(IO_L21P_T3L_N4_AD8P_D06_65) ; port QSPI1.QSPI_IO2
QSPI1_IO3: IC27.R22(IO_L21N_T3L_N5_AD8N_D07_65) ; port QSPI1.QSPI_IO3
REC_CLOCK: IC27.H27(IO_L1P_T0L_N0_DBC_RS0_65) ; port REC_CLOCK
REF_CLK_SEL: IC27.G27(IO_L1N_T0L_N1_DBC_RS1_65) ; port REF_CLK_SEL
RGMII2_MDC: IC27.T27(IO_L15P_T2L_N4_AD11P_A02_D18_65) ; port ETH2_RGMII.RGMII2_MDC  [project net ETH2_RGMII.RGMII2_MDC]
RGMII2_MDIO: IC27.R27(IO_L15N_T2L_N5_AD11N_A03_D19_65) ; port ETH2_RGMII.RGMII2_MDIO  [project net ETH2_RGMII.RGMII2_MDIO]
RGMII2_RX_CLK: IC27.P24(IO_L14P_T2L_N2_GC_A04_D20_65) ; port ETH2_RGMII.RGMII2_RX_CLK  [project net ETH2_RGMII.RGMII2_RX_CLK]
RGMII2_RX_CTL: IC27.T24(IO_L16P_T2U_N6_QBC_AD3P_A00_D16_65) ; port ETH2_RGMII.RGMII2_RX_CTL  [project net ETH2_RGMII.RGMII2_RX_CTL]
RGMII2_RXD0: IC27.R23(IO_L18P_T2U_N10_AD2P_D12_65)
RGMII2_RXD1: IC27.P23(IO_L18N_T2U_N11_AD2N_D13_65)
RGMII2_RXD2: IC27.R25(IO_L17P_T2U_N8_AD10P_D14_65)
RGMII2_RXD3: IC27.R26(IO_L17N_T2U_N9_AD10N_D15_65)
RGMII2_TX_CLK: IC27.M22(IO_L19N_T3L_N1_DBC_AD9N_D11_65) ; port ETH2_RGMII.RGMII2_TX_CLK  [project net ETH2_RGMII.RGMII2_TX_CLK]
RGMII2_TX_CTL: IC27.N22(IO_L19P_T3L_N0_DBC_AD9P_D10_65) ; port ETH2_RGMII.RGMII2_TX_CTL  [project net ETH2_RGMII.RGMII2_TX_CTL]
RGMII2_TXD0: IC27.K20(IO_L24P_T3U_N10_EMCCLK_65)
RGMII2_TXD1: IC27.K22(IO_T3U_N12_PERSTN0_65)
RGMII2_TXD2: IC27.P20(IO_L20P_T3L_N2_AD1P_D08_65)
RGMII2_TXD3: IC27.P21(IO_L20N_T3L_N3_AD1N_D09_65)
SI5324_RST: IC27.AH13(IO_L8P_T1L_N2_AD5P_64) ; port SI5324_RST
Vbias_1.6: C608.1 R405.1 R406.1 R407.1 R408.1 R409.1 R410.1 R412.1 R413.2

Not connected (* = marked no-connect by the designer): IC27 L23(IO_L8P_T1L_N2_AD5P_A16_65)

### Buses and harness runs
bus RGMII2_RXD[0..3]
bus RGMII2_TXD[0..3]
harness DACs_IN = port DACs_IN

### Notes on the sheet
- Bank 64 HR P1V8
- (near IC27) We don't need series termination resistors for RGMII - The PHY was moved closed to FPGA and traces are only 2..3cm long.
- Bank 65 HR P3V3
- CPU<-> FPGA communication
- Copyright ISE WUT 2026.
- This documentation describes Open Hardware and is
- (http://ohwr.org/CERNOHL). This documentation is
- redistribute and modify this documentation under the
- terms of the CERN OHL v.2.2.
- distributed WITHOUT ANY EXPRESS OR IMPLIED
- licensed under the CERN OHL v.2.2. You may
- AND FITNESS FOR A PARTICULAR PURPOSE.
- Please see the CERN OHL v.2.2 for applicable
- conditions.
- WARRANTY, INCLUDING OF
- MERCHANTABILITY, SATISFACTORY QUALITY
- Project/Equipment
- Document
- Designer
- Drawn by
- Check.by
- File
- Last Mod.
- Print Date
- Sheet
- Size
- A3
- of
- Rev
- (in symbol R0402_10K_1%_0.0625W_100PPM) 1%
- (in symbol R0402_100R_1%_0.0625W_100PPM) 1%
- (in symbol R0402_240R_1%_0.0625W_100PPM) 1%
- (in symbol XCKU040-1FFVA1156C, part F) BANK 64
- (in symbol XCKU040-1FFVA1156C, part G) BANK 65

### Library data of the parts
C608 = CC0201_100NF_6.3V_10%_X5R: Non-polarised capacitor; Part Description: SMD Multilayer Chip Ceramic Capacitor; Manufacturer: GENERIC; Manufacturer1 Part Number: 02016D104KAT2A; Voltage: 6.3V; TC: X5R; Tolerance: ±10%; Part Number: CC0201_100NF_6.3V_10%_X5R; Component Kind: Standard; Component Type: Standard; Pin Count: 2; Value: 100nF; Status: Not Recommended; Manufacturer Part Number: CC0201_100NF_6.3V_10%_X5R; Case: 0201; Mounted: Yes; Socket: No; SMD: Yes; Sense: No; Manufacturer1 Example: AVX; Manufacturer1 ComponentHeight: 0.33mm; HelpURL: \\cern.ch\dfs\Applications\Altium\Datasheets\CC0201_X5R_AVX.pdf; Author: CERN DEM JLC; CreateDate: 03.12.2007; LatestRevisionDate: 03.12.2007
IC27 = XCKU040-1FFVA1156C: Kintex UltraScale FPGA, 520 I/O, 530K Cells, 1156-Ball BGA, Speed Grade 1, Commercial Grade; Part Description: Kintex UltraScale, 40 DLL I/O, 416 HP I/O, 104 HR I/O, 1156-Pin BGA, Speed Grade 1, Commercial Grade; Manufacturer: XILINX; PressFit: No; Bonding: No; Part Number: XCKU040-1FFVA1156C; Component Kind: Standard; Component Type: Standard; Device: XCKU040-1FFVA1156C; PackageDescription: BGA, 1.00mm Pitch, Square; 1156 Pin, 34 Columns X 34 Rows, Body 35.00mm X 35.00mm X 3.50mm H, IPC Medium Density; Manufacturer Part Number: XCKU040-1FFVA1156C; Pin Count: 1156; Case: BGA1156; Mounted: Yes; Socket: No; SMD: Yes; Sense: No; ComponentHeight: 3.5mm; HelpURL: \\cern.ch\dfs\Applications\Altium\Datasheets\XCKU040-1FFVA1156C.pdf; ComponentLink1URL: \\cern.ch\dfs\Applications\Altium\Datasheets\XCKU040-1FFVA1156C_Package-Pinout.pdf; ComponentLink1Description: Package/Pinout; Author: CERN DEM CA; CreateDate: 16.08.2016; LatestRevisionDate: 16.08.2016
R405 R406 = R0402_NO-VALUE: Resistor; Part Description: Reserved Footprint For a 0402 (1005) Chip Resistor; PressFit: No; Mounted: No; Part Number: R0402_NO-VALUE; Component Kind: Standard; Component Type: Standard; Pin Count: 2; Value: Undefined; Status: None; Manufacturer: Undefined; Manufacturer Part Number: R0402_NO-VALUE; Case: 0402; Sense: No; Socket: No; SMD: Yes; Manufacturer1 Example: Undefined; Manufacturer1 Part Number: Undefined; Manufacturer1 ComponentHeight: Undefined; HelpURL: Undefined; Author: CERN DEM JLC; CreateDate: 03.12.2007; LatestRevisionDate: 13.03.2008
R407-R410 = R0402_10K_1%_0.0625W_100PPM: Resistor - 1%; Part Description: General Purpose Thick Film Chip Resistor; Manufacturer: GENERIC; Manufacturer1 Part Number: 232270671003L; TC: ±100ppm/°C; PressFit: No; Part Number: R0402_10K_1%_0.0625W_100PPM; Component Kind: Standard; Component Type: Standard; Pin Count: 2; Value: 10k; Status: Not Recommended; Power: 0.0625W; Tolerance: ±1%; Manufacturer Part Number: R0402_10K_1%_0.0625W_100PPM; Case: 0402; Mounted: Yes; Sense: No; Socket: No; SMD: Yes; Manufacturer1 Example: YAGEO PHYCOMP; Manufacturer1 ComponentHeight: 0.4mm; HelpURL: \\cern.ch\dfs\Applications\Altium\Datasheets\R0402_Phycomp_RC0402.pdf; Author: CERN DEM JLC; CreateDate: 03.12.2007; LatestRevisionDate: 17.10.2012
R411 = R0402_100R_1%_0.0625W_100PPM: Resistor - 1%; Part Description: General Purpose Thick Film Chip Resistor; Manufacturer: GENERIC; Manufacturer1 Part Number: 232270671001L; TC: ±100ppm/°C; PressFit: No; Part Number: R0402_100R_1%_0.0625W_100PPM; Component Kind: Standard; Component Type: Standard; Pin Count: 2; Value: 100; Status: Not Recommended; Power: 0.0625W; Tolerance: ±1%; Manufacturer Part Number: R0402_100R_1%_0.0625W_100PPM; Case: 0402; Mounted: Yes; Sense: No; Socket: No; SMD: Yes; Manufacturer1 Example: YAGEO PHYCOMP; Manufacturer1 ComponentHeight: 0.4mm; HelpURL: \\cern.ch\dfs\Applications\Altium\Datasheets\R0402_Phycomp_RC0402.pdf; Author: CERN DEM JLC; CreateDate: 03.12.2007; LatestRevisionDate: 17.10.2012
R412 R413 = R0402_240R_1%_0.0625W_100PPM: Resistor - 1%; Part Description: General Purpose Thick Film Chip Resistor; Manufacturer: GENERIC; Manufacturer1 Part Number: 232270672401L; TC: ±100ppm/°C; PressFit: No; Part Number: R0402_240R_1%_0.0625W_100PPM; Component Kind: Standard; Component Type: Standard; Pin Count: 2; Value: 240; Status: Not Recommended; Power: 0.0625W; Tolerance: ±1%; Manufacturer Part Number: R0402_240R_1%_0.0625W_100PPM; Case: 0402; Mounted: Yes; Sense: No; Socket: No; SMD: Yes; Manufacturer1 Example: YAGEO PHYCOMP; Manufacturer1 ComponentHeight: 0.4mm; HelpURL: \\cern.ch\dfs\Applications\Altium\Datasheets\R0402_Phycomp_RC0402.pdf; Author: CERN DEM JLC; CreateDate: 03.12.2007; LatestRevisionDate: 17.10.2012

## Sheet FPGA_Power.SchDoc: =ProjectName
size 420 x 297 mm; Author: T.P.; CompanyName: WUT; DrawnBy: T.P.; Organization: WUT ISE; Address1: Warsaw Univeristy of Technology; Address2: Nowowiejska 15/19; DocumentNumber: 11; Revision: 0.9; SheetNumber: 11; SheetTotal: 36; EDA_Number: ARTIQ; Projet: ARTIQ/SINARA; ModifiedBy: -; CreateDate: XX/XX/XXXX; CheckedDate: -; Title2: FPGA_Power.SchDoc; DivGrp: ISE; Designer: G.K. and T.P.; ModifiedDate: -; ProjectName: ADC/DAC MEZZANINE
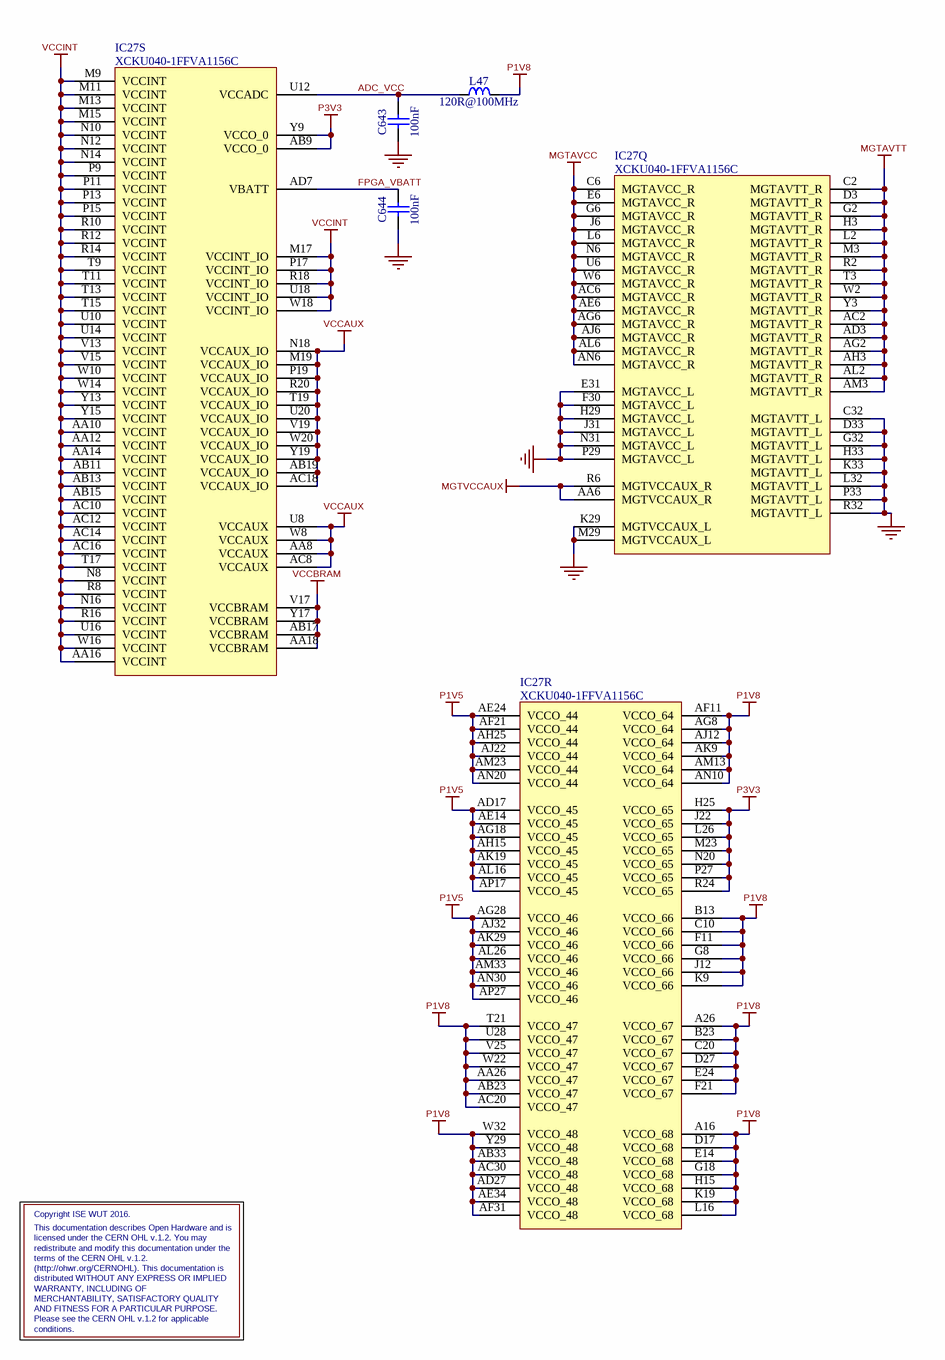
[diagram p34: FPGA_Power.SchDoc]

### Parts
C643  100nF  [CAPC0603X33N]
C644  100nF  [CAPC0603X33N]
IC27  XCKU040-1FFVA1156C  [BGA1156C100P34X34_3500X3500X350]  (parts Q,R,S of 22)
L47  120R@100MHz  [INDC1005X55N]

### Nets
GND: C643.1 C644.1 IC27.C32(MGTAVTT_L) IC27.D33(MGTAVTT_L) IC27.E31(MGTAVCC_L) IC27.F30(MGTAVCC_L) IC27.G32(MGTAVTT_L) IC27.H29(MGTAVCC_L) IC27.H33(MGTAVTT_L) IC27.J31(MGTAVCC_L) IC27.K29(MGTVCCAUX_L) IC27.K33(MGTAVTT_L) IC27.L32(MGTAVTT_L) IC27.M29(MGTVCCAUX_L) IC27.N31(MGTAVCC_L) IC27.P29(MGTAVCC_L) IC27.P33(MGTAVTT_L) IC27.R32(MGTAVTT_L)
MGTAVCC: IC27.AC6(MGTAVCC_R) IC27.AE6(MGTAVCC_R) IC27.AG6(MGTAVCC_R) IC27.AJ6(MGTAVCC_R) IC27.AL6(MGTAVCC_R) IC27.AN6(MGTAVCC_R) IC27.C6(MGTAVCC_R) IC27.E6(MGTAVCC_R) IC27.G6(MGTAVCC_R) IC27.J6(MGTAVCC_R) IC27.L6(MGTAVCC_R) IC27.N6(MGTAVCC_R) IC27.U6(MGTAVCC_R) IC27.W6(MGTAVCC_R)
MGTAVTT: IC27.AC2(MGTAVTT_R) IC27.AD3(MGTAVTT_R) IC27.AG2(MGTAVTT_R) IC27.AH3(MGTAVTT_R) IC27.AL2(MGTAVTT_R) IC27.AM3(MGTAVTT_R) IC27.C2(MGTAVTT_R) IC27.D3(MGTAVTT_R) IC27.G2(MGTAVTT_R) IC27.H3(MGTAVTT_R) IC27.L2(MGTAVTT_R) IC27.M3(MGTAVTT_R) IC27.R2(MGTAVTT_R) IC27.T3(MGTAVTT_R) IC27.W2(MGTAVTT_R) IC27.Y3(MGTAVTT_R)
MGTVCCAUX: IC27.AA6(MGTVCCAUX_R) IC27.R6(MGTVCCAUX_R)
P1V5: IC27.AD17(VCCO_45) IC27.AE14(VCCO_45) IC27.AE24(VCCO_44) IC27.AF21(VCCO_44) IC27.AG18(VCCO_45) IC27.AG28(VCCO_46) IC27.AH15(VCCO_45) IC27.AH25(VCCO_44) IC27.AJ22(VCCO_44) IC27.AJ32(VCCO_46) IC27.AK19(VCCO_45) IC27.AK29(VCCO_46) IC27.AL16(VCCO_45) IC27.AL26(VCCO_46) IC27.AM23(VCCO_44) IC27.AM33(VCCO_46) IC27.AN20(VCCO_44) IC27.AN30(VCCO_46) IC27.AP17(VCCO_45) IC27.AP27(VCCO_46)
P1V8: IC27.A16(VCCO_68) IC27.A26(VCCO_67) IC27.AA26(VCCO_47) IC27.AB23(VCCO_47) IC27.AB33(VCCO_48) IC27.AC20(VCCO_47) IC27.AC30(VCCO_48) IC27.AD27(VCCO_48) IC27.AE34(VCCO_48) IC27.AF11(VCCO_64) IC27.AF31(VCCO_48) IC27.AG8(VCCO_64) IC27.AJ12(VCCO_64) IC27.AK9(VCCO_64) IC27.AM13(VCCO_64) IC27.AN10(VCCO_64) IC27.B13(VCCO_66) IC27.B23(VCCO_67) IC27.C10(VCCO_66) IC27.C20(VCCO_67) IC27.D17(VCCO_68) IC27.D27(VCCO_67) IC27.E14(VCCO_68) IC27.E24(VCCO_67) IC27.F11(VCCO_66) IC27.F21(VCCO_67) IC27.G8(VCCO_66) IC27.G18(VCCO_68) IC27.H15(VCCO_68) IC27.J12(VCCO_66) IC27.K9(VCCO_66) IC27.K19(VCCO_68) IC27.L16(VCCO_68) IC27.T21(VCCO_47) IC27.U28(VCCO_47) IC27.V25(VCCO_47) IC27.W22(VCCO_47) IC27.W32(VCCO_48) IC27.Y29(VCCO_48) L47.2
P3V3: IC27.AB9(VCCO_0) IC27.H25(VCCO_65) IC27.J22(VCCO_65) IC27.L26(VCCO_65) IC27.M23(VCCO_65) IC27.N20(VCCO_65) IC27.P27(VCCO_65) IC27.R24(VCCO_65) IC27.Y9(VCCO_0)
VCCAUX: IC27.AA8(VCCAUX) IC27.AB19(VCCAUX_IO) IC27.AC8(VCCAUX) IC27.AC18(VCCAUX_IO) IC27.M19(VCCAUX_IO) IC27.N18(VCCAUX_IO) IC27.P19(VCCAUX_IO) IC27.R20(VCCAUX_IO) IC27.T19(VCCAUX_IO) IC27.U8(VCCAUX) IC27.U20(VCCAUX_IO) IC27.V19(VCCAUX_IO) IC27.W8(VCCAUX) IC27.W20(VCCAUX_IO) IC27.Y19(VCCAUX_IO)
VCCBRAM: IC27.AA18(VCCBRAM) IC27.AB17(VCCBRAM) IC27.V17(VCCBRAM) IC27.Y17(VCCBRAM)
VCCINT: IC27.AA10(VCCINT) IC27.AA12(VCCINT) IC27.AA14(VCCINT) IC27.AA16(VCCINT) IC27.AB11(VCCINT) IC27.AB13(VCCINT) IC27.AB15(VCCINT) IC27.AC10(VCCINT) IC27.AC12(VCCINT) IC27.AC14(VCCINT) IC27.AC16(VCCINT) IC27.M9(VCCINT) IC27.M11(VCCINT) IC27.M13(VCCINT) IC27.M15(VCCINT) IC27.M17(VCCINT_IO) IC27.N8(VCCINT) IC27.N10(VCCINT) IC27.N12(VCCINT) IC27.N14(VCCINT) IC27.N16(VCCINT) IC27.P9(VCCINT) IC27.P11(VCCINT) IC27.P13(VCCINT) IC27.P15(VCCINT) IC27.P17(VCCINT_IO) IC27.R8(VCCINT) IC27.R10(VCCINT) IC27.R12(VCCINT) IC27.R14(VCCINT) IC27.R16(VCCINT) IC27.R18(VCCINT_IO) IC27.T9(VCCINT) IC27.T11(VCCINT) IC27.T13(VCCINT) IC27.T15(VCCINT) IC27.T17(VCCINT) IC27.U10(VCCINT) IC27.U14(VCCINT) IC27.U16(VCCINT) IC27.U18(VCCINT_IO) IC27.V13(VCCINT) IC27.V15(VCCINT) IC27.W10(VCCINT) IC27.W14(VCCINT) IC27.W16(VCCINT) IC27.W18(VCCINT_IO) IC27.Y13(VCCINT) IC27.Y15(VCCINT)
ADC_VCC: C643.2 IC27.U12(VCCADC) L47.1
FPGA_VBATT: C644.2 IC27.AD7(VBATT)

### Notes on the sheet
- distributed WITHOUT ANY EXPRESS OR IMPLIED
- redistribute and modify this documentation under the
- licensed under the CERN OHL v.1.2. You may
- Copyright ISE WUT 2016.
- (http://ohwr.org/CERNOHL). This documentation is
- This documentation describes Open Hardware and is
- terms of the CERN OHL v.1.2.
- Please see the CERN OHL v.1.2 for applicable
- WARRANTY, INCLUDING OF
- conditions.
- MERCHANTABILITY, SATISFACTORY QUALITY
- AND FITNESS FOR A PARTICULAR PURPOSE.
- Project/Equipment
- Document
- Designer
- Drawn by
- Check.by
- File
- Last Mod.
- Print Date
- Sheet
- Size
- A3
- of
- Rev

### Library data of the parts
C643 C644 = CC0201_100NF_6.3V_10%_X5R: Non-polarised capacitor; Manufacturer: GENERIC; Part Description: SMD Multilayer Chip Ceramic Capacitor; Manufacturer1 Part Number: 02016D104KAT2A; Tolerance: ±10%; Voltage: 6.3V; TC: X5R; Manufacturer Part Number: CC0201_100NF_6.3V_10%_X5R; Part Number: CC0201_100NF_6.3V_10%_X5R; Value: 100nF; Component Kind: Standard; Component Type: Standard; Pin Count: 2; Status: Not Recommended; Case: 0201; Mounted: Yes; Socket: No; SMD: Yes; Sense: No; Manufacturer1 Example: AVX; Manufacturer1 ComponentHeight: 0.33mm; HelpURL: \\cern.ch\dfs\Applications\Altium\Datasheets\CC0201_X5R_AVX.pdf; Author: CERN DEM JLC; CreateDate: 03.12.2007; LatestRevisionDate: 03.12.2007
IC27 = XCKU040-1FFVA1156C: as IC27 on sheet FPGA_Banks_67_68; Manufacturer Part Number: XCKU040-1FFVA1156C; PackageDescription: BGA, 1.00mm Pitch, Square; 1156 Pin, 34 Columns X 34 Rows, Body 35.00mm X 35.00mm X 3.50mm H, IPC Medium Density; Part Number: XCKU040-1FFVA1156C; Component Kind: Standard; Component Type: Standard; Device: XCKU040-1FFVA1156C; Pin Count: 1156; Case: BGA1156; Mounted: Yes; Socket: No; SMD: Yes; Sense: No; ComponentHeight: 3.5mm; HelpURL: \\cern.ch\dfs\Applications\Altium\Datasheets\XCKU040-1FFVA1156C.pdf; ComponentLink1URL: \\cern.ch\dfs\Applications\Altium\Datasheets\XCKU040-1FFVA1156C_Package-Pinout.pdf; ComponentLink1Description: Package/Pinout; Author: CERN DEM CA; CreateDate: 16.08.2016; LatestRevisionDate: 16.08.2016
L47 = IND0402_MURATA_BLM15PX121SN1D: Inductor; Manufacturer: MURATA; Part Description: SMD EMIFIL Chip Ferrite Bead; Tolerance: ±25%; Power: 2A; Resistance: 0.055R; Manufacturer Part Number: BLM15PX121SN1D; Part Number: IND0402_MURATA_BLM15PX121SN1D; Value: 120R@100MHz; Component Kind: Standard; Component Type: Standard; Pin Count: 2; Status: None; Case: 0402; Mounted: Yes; Socket: No; SMD: Yes; Sense: No; ComponentHeight: 0.55mm; HelpURL: \\cern.ch\dfs\Applications\Altium\Datasheets\IND0402_MURATA_BLM15PX.pdf; Author: CERN DEM JMW; CreateDate: 19.02.2014; LatestRevisionDate: 19.02.2014

## Sheet FPGA_GND_NC.SchDoc: =ProjectName
size 420 x 297 mm; Author: T.P.; CompanyName: WUT; DrawnBy: T.P.; Organization: WUT ISE; Address1: Warsaw Univeristy of Technology; Address2: Nowowiejska 15/19; DocumentNumber: 13; Revision: 0.9; SheetNumber: 13; SheetTotal: 36; EDA_Number: ARTIQ; Projet: ARTIQ/SINARA; ModifiedBy: -; CreateDate: XX/XX/XXXX; CheckedDate: -; Title2: FPGA_GND_NC.SchDoc; DivGrp: ISE; Designer: G.K. and T.P.; ModifiedDate: -; ProjectName: ADC/DAC MEZZANINE
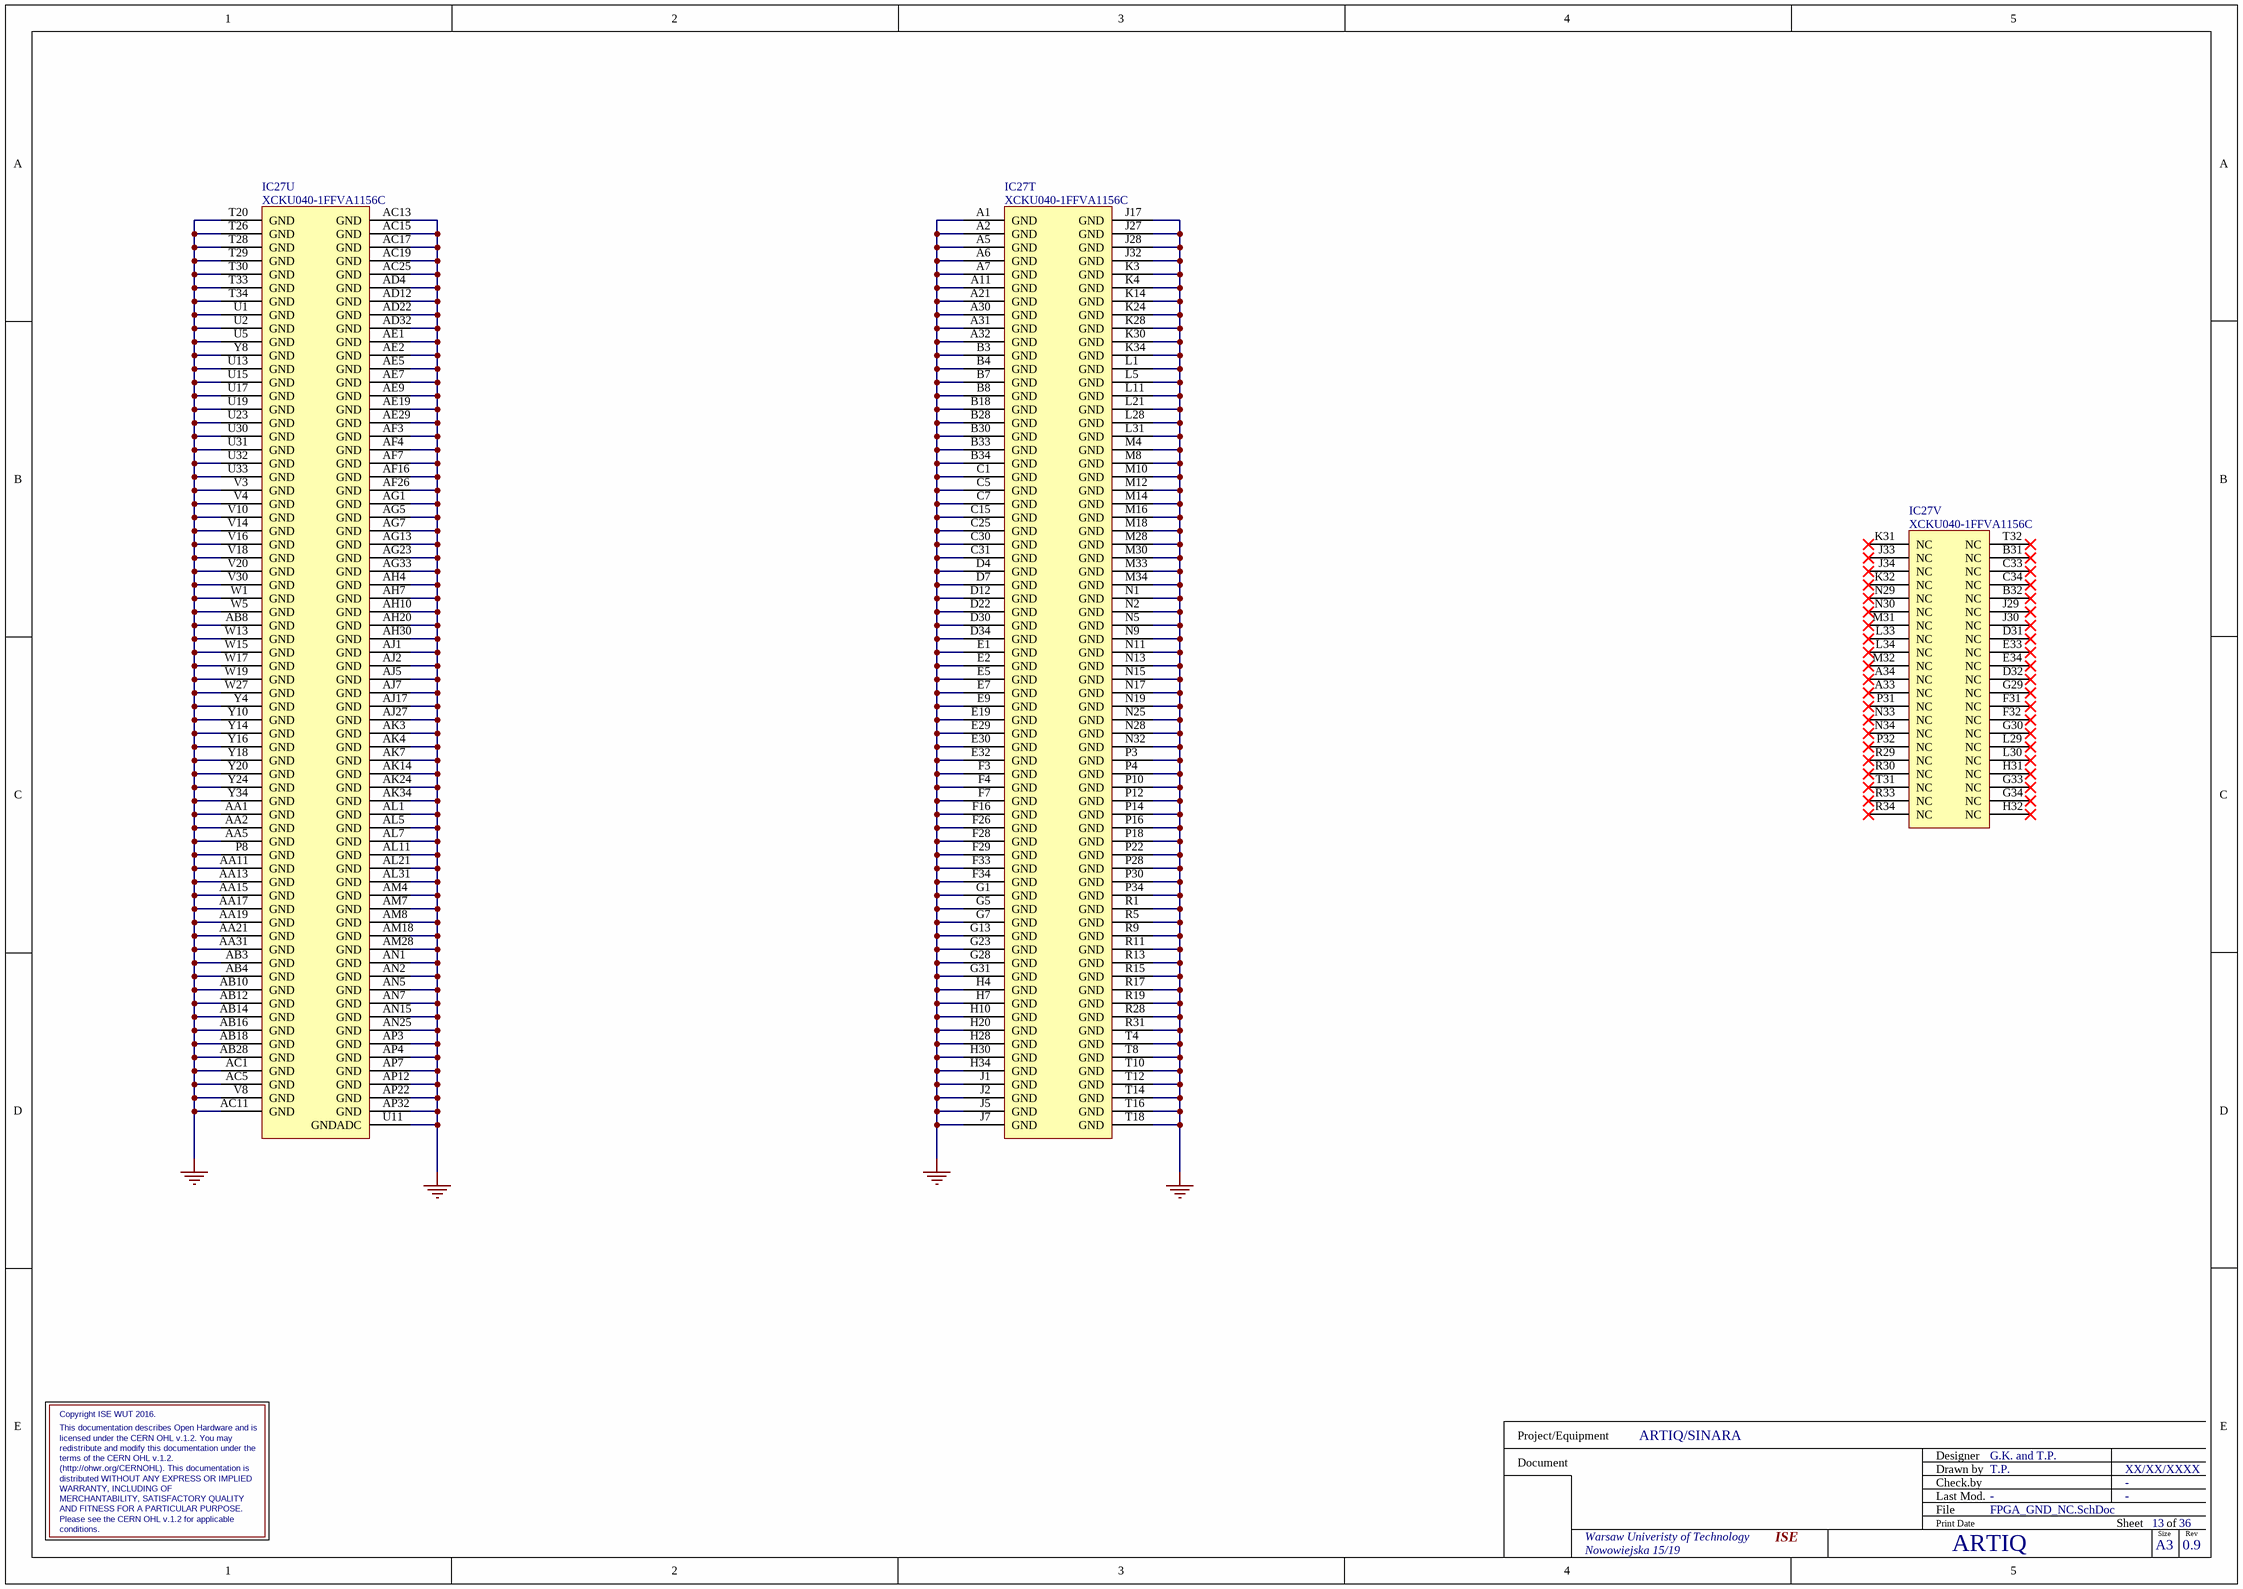
[diagram p35: FPGA_GND_NC.SchDoc]

### Parts
IC27  XCKU040-1FFVA1156C  [BGA1156C100P34X34_3500X3500X350]  (parts T,U,V of 22)

### Nets
GND: IC27.A1(GND) IC27.A2(GND) IC27.A5(GND) IC27.A6(GND) IC27.A7(GND) IC27.A11(GND) IC27.A21(GND) IC27.A30(GND) IC27.A31(GND) IC27.A32(GND) IC27.AA1(GND) IC27.AA2(GND) IC27.AA5(GND) IC27.AA11(GND) IC27.AA13(GND) IC27.AA15(GND) IC27.AA17(GND) IC27.AA19(GND) IC27.AA21(GND) IC27.AA31(GND) IC27.AB3(GND) IC27.AB4(GND) IC27.AB8(GND) IC27.AB10(GND) IC27.AB12(GND) IC27.AB14(GND) IC27.AB16(GND) IC27.AB18(GND) IC27.AB28(GND) IC27.AC1(GND) IC27.AC5(GND) IC27.AC11(GND) IC27.AC13(GND) IC27.AC15(GND) IC27.AC17(GND) IC27.AC19(GND) IC27.AC25(GND) IC27.AD4(GND) IC27.AD12(GND) IC27.AD22(GND) IC27.AD32(GND) IC27.AE1(GND) IC27.AE2(GND) IC27.AE5(GND) IC27.AE7(GND) IC27.AE9(GND) IC27.AE19(GND) IC27.AE29(GND) IC27.AF3(GND) IC27.AF4(GND) IC27.AF7(GND) IC27.AF16(GND) IC27.AF26(GND) IC27.AG1(GND) IC27.AG5(GND) IC27.AG7(GND) IC27.AG13(GND) IC27.AG23(GND) IC27.AG33(GND) IC27.AH4(GND) IC27.AH7(GND) IC27.AH10(GND) IC27.AH20(GND) IC27.AH30(GND) IC27.AJ1(GND) IC27.AJ2(GND) IC27.AJ5(GND) IC27.AJ7(GND) IC27.AJ17(GND) IC27.AJ27(GND) IC27.AK3(GND) IC27.AK4(GND) IC27.AK7(GND) IC27.AK14(GND) IC27.AK24(GND) IC27.AK34(GND) IC27.AL1(GND) IC27.AL5(GND) IC27.AL7(GND) IC27.AL11(GND) IC27.AL21(GND) IC27.AL31(GND) IC27.AM4(GND) IC27.AM7(GND) IC27.AM8(GND) IC27.AM18(GND) IC27.AM28(GND) IC27.AN1(GND) IC27.AN2(GND) IC27.AN5(GND) IC27.AN7(GND) IC27.AN15(GND) IC27.AN25(GND) IC27.AP3(GND) IC27.AP4(GND) IC27.AP7(GND) IC27.AP12(GND) IC27.AP22(GND) IC27.AP32(GND) IC27.B3(GND) IC27.B4(GND) IC27.B7(GND) IC27.B8(GND) IC27.B18(GND) IC27.B28(GND) IC27.B30(GND) IC27.B33(GND) IC27.B34(GND) IC27.C1(GND) IC27.C5(GND) IC27.C7(GND) IC27.C15(GND) IC27.C25(GND) IC27.C30(GND) IC27.C31(GND) IC27.D4(GND) IC27.D7(GND) IC27.D12(GND) IC27.D22(GND) IC27.D30(GND) IC27.D34(GND) IC27.E1(GND) IC27.E2(GND) IC27.E5(GND) IC27.E7(GND) IC27.E9(GND) IC27.E19(GND) IC27.E29(GND) IC27.E30(GND) IC27.E32(GND) IC27.F3(GND) IC27.F4(GND) IC27.F7(GND) IC27.F16(GND) IC27.F26(GND) IC27.F28(GND) IC27.F29(GND) IC27.F33(GND) IC27.F34(GND) IC27.G1(GND) IC27.G5(GND) IC27.G7(GND) IC27.G13(GND) IC27.G23(GND) IC27.G28(GND) IC27.G31(GND) IC27.H4(GND) IC27.H7(GND) IC27.H10(GND) IC27.H20(GND) IC27.H28(GND) IC27.H30(GND) IC27.H34(GND) IC27.J1(GND) IC27.J2(GND) IC27.J5(GND) IC27.J7(GND) IC27.J17(GND) IC27.J27(GND) IC27.J28(GND) IC27.J32(GND) IC27.K3(GND) IC27.K4(GND) IC27.K14(GND) IC27.K24(GND) IC27.K28(GND) IC27.K30(GND) IC27.K34(GND) IC27.L1(GND) IC27.L5(GND) IC27.L11(GND) IC27.L21(GND) IC27.L28(GND) IC27.L31(GND) IC27.M4(GND) IC27.M8(GND) IC27.M10(GND) IC27.M12(GND) IC27.M14(GND) IC27.M16(GND) IC27.M18(GND) IC27.M28(GND) IC27.M30(GND) IC27.M33(GND) IC27.M34(GND) IC27.N1(GND) IC27.N2(GND) IC27.N5(GND) IC27.N9(GND) IC27.N11(GND) IC27.N13(GND) IC27.N15(GND) IC27.N17(GND) IC27.N19(GND) IC27.N25(GND) IC27.N28(GND) IC27.N32(GND) IC27.P3(GND) IC27.P4(GND) IC27.P8(GND) IC27.P10(GND) IC27.P12(GND) IC27.P14(GND) IC27.P16(GND) IC27.P18(GND) IC27.P22(GND) IC27.P28(GND) IC27.P30(GND) IC27.P34(GND) IC27.R1(GND) IC27.R5(GND) IC27.R9(GND) IC27.R11(GND) IC27.R13(GND) IC27.R15(GND) IC27.R17(GND) IC27.R19(GND) IC27.R28(GND) IC27.R31(GND) IC27.T4(GND) IC27.T8(GND) IC27.T10(GND) IC27.T12(GND) IC27.T14(GND) IC27.T16(GND) IC27.T18(GND) IC27.T20(GND) IC27.T26(GND) IC27.T28(GND) IC27.T29(GND) IC27.T30(GND) IC27.T33(GND) IC27.T34(GND) IC27.U1(GND) IC27.U2(GND) IC27.U5(GND) IC27.U11(GNDADC) IC27.U13(GND) IC27.U15(GND) IC27.U17(GND) IC27.U19(GND) IC27.U23(GND) IC27.U30(GND) IC27.U31(GND) IC27.U32(GND) IC27.U33(GND) IC27.V3(GND) IC27.V4(GND) IC27.V8(GND) IC27.V10(GND) IC27.V14(GND) IC27.V16(GND) IC27.V18(GND) IC27.V20(GND) IC27.V30(GND) IC27.W1(GND) IC27.W5(GND) IC27.W13(GND) IC27.W15(GND) IC27.W17(GND) IC27.W19(GND) IC27.W27(GND) IC27.Y4(GND) IC27.Y8(GND) IC27.Y10(GND) IC27.Y14(GND) IC27.Y16(GND) IC27.Y18(GND) IC27.Y20(GND) IC27.Y24(GND) IC27.Y34(GND)

Not connected (* = marked no-connect by the designer): IC27 A33(NC)* A34(NC)* B31(NC)* B32(NC)* C33(NC)* C34(NC)* D31(NC)* D32(NC)* E33(NC)* E34(NC)* F31(NC)* F32(NC)* G29(NC)* G30(NC)* G33(NC)* G34(NC)* H31(NC)* H32(NC)* J29(NC)* J30(NC)* J33(NC)* J34(NC)* K31(NC)* K32(NC)* L29(NC)* L30(NC)* L33(NC)* L34(NC)* M31(NC)* M32(NC)* N29(NC)* N30(NC)* N33(NC)* N34(NC)* P31(NC)* P32(NC)* R29(NC)* R30(NC)* R33(NC)* R34(NC)* T31(NC)* T32(NC)*

### Notes on the sheet
- Copyright ISE WUT 2016.
- licensed under the CERN OHL v.1.2. You may
- (http://ohwr.org/CERNOHL). This documentation is
- distributed WITHOUT ANY EXPRESS OR IMPLIED
- terms of the CERN OHL v.1.2.
- redistribute and modify this documentation under the
- This documentation describes Open Hardware and is
- WARRANTY, INCLUDING OF
- MERCHANTABILITY, SATISFACTORY QUALITY
- Please see the CERN OHL v.1.2 for applicable
- conditions.
- AND FITNESS FOR A PARTICULAR PURPOSE.
- Project/Equipment
- Document
- Designer
- Drawn by
- Check.by
- File
- Last Mod.
- Print Date
- Sheet
- Size
- A3
- of
- Rev

### Library data of the parts
IC27 = XCKU040-1FFVA1156C: as IC27 on sheet FPGA_Banks_67_68; Manufacturer Part Number: XCKU040-1FFVA1156C; PackageDescription: BGA, 1.00mm Pitch, Square; 1156 Pin, 34 Columns X 34 Rows, Body 35.00mm X 35.00mm X 3.50mm H, IPC Medium Density; Part Number: XCKU040-1FFVA1156C; Component Kind: Standard; Component Type: Standard; Device: XCKU040-1FFVA1156C; Pin Count: 1156; Case: BGA1156; Mounted: Yes; Socket: No; SMD: Yes; Sense: No; ComponentHeight: 3.5mm; HelpURL: \\cern.ch\dfs\Applications\Altium\Datasheets\XCKU040-1FFVA1156C.pdf; ComponentLink1URL: \\cern.ch\dfs\Applications\Altium\Datasheets\XCKU040-1FFVA1156C_Package-Pinout.pdf; ComponentLink1Description: Package/Pinout; Author: CERN DEM CA; CreateDate: 16.08.2016; LatestRevisionDate: 16.08.2016